# EAGLE design clock10 (EAGLE 7.7.0)

## Sheet 1 of 3
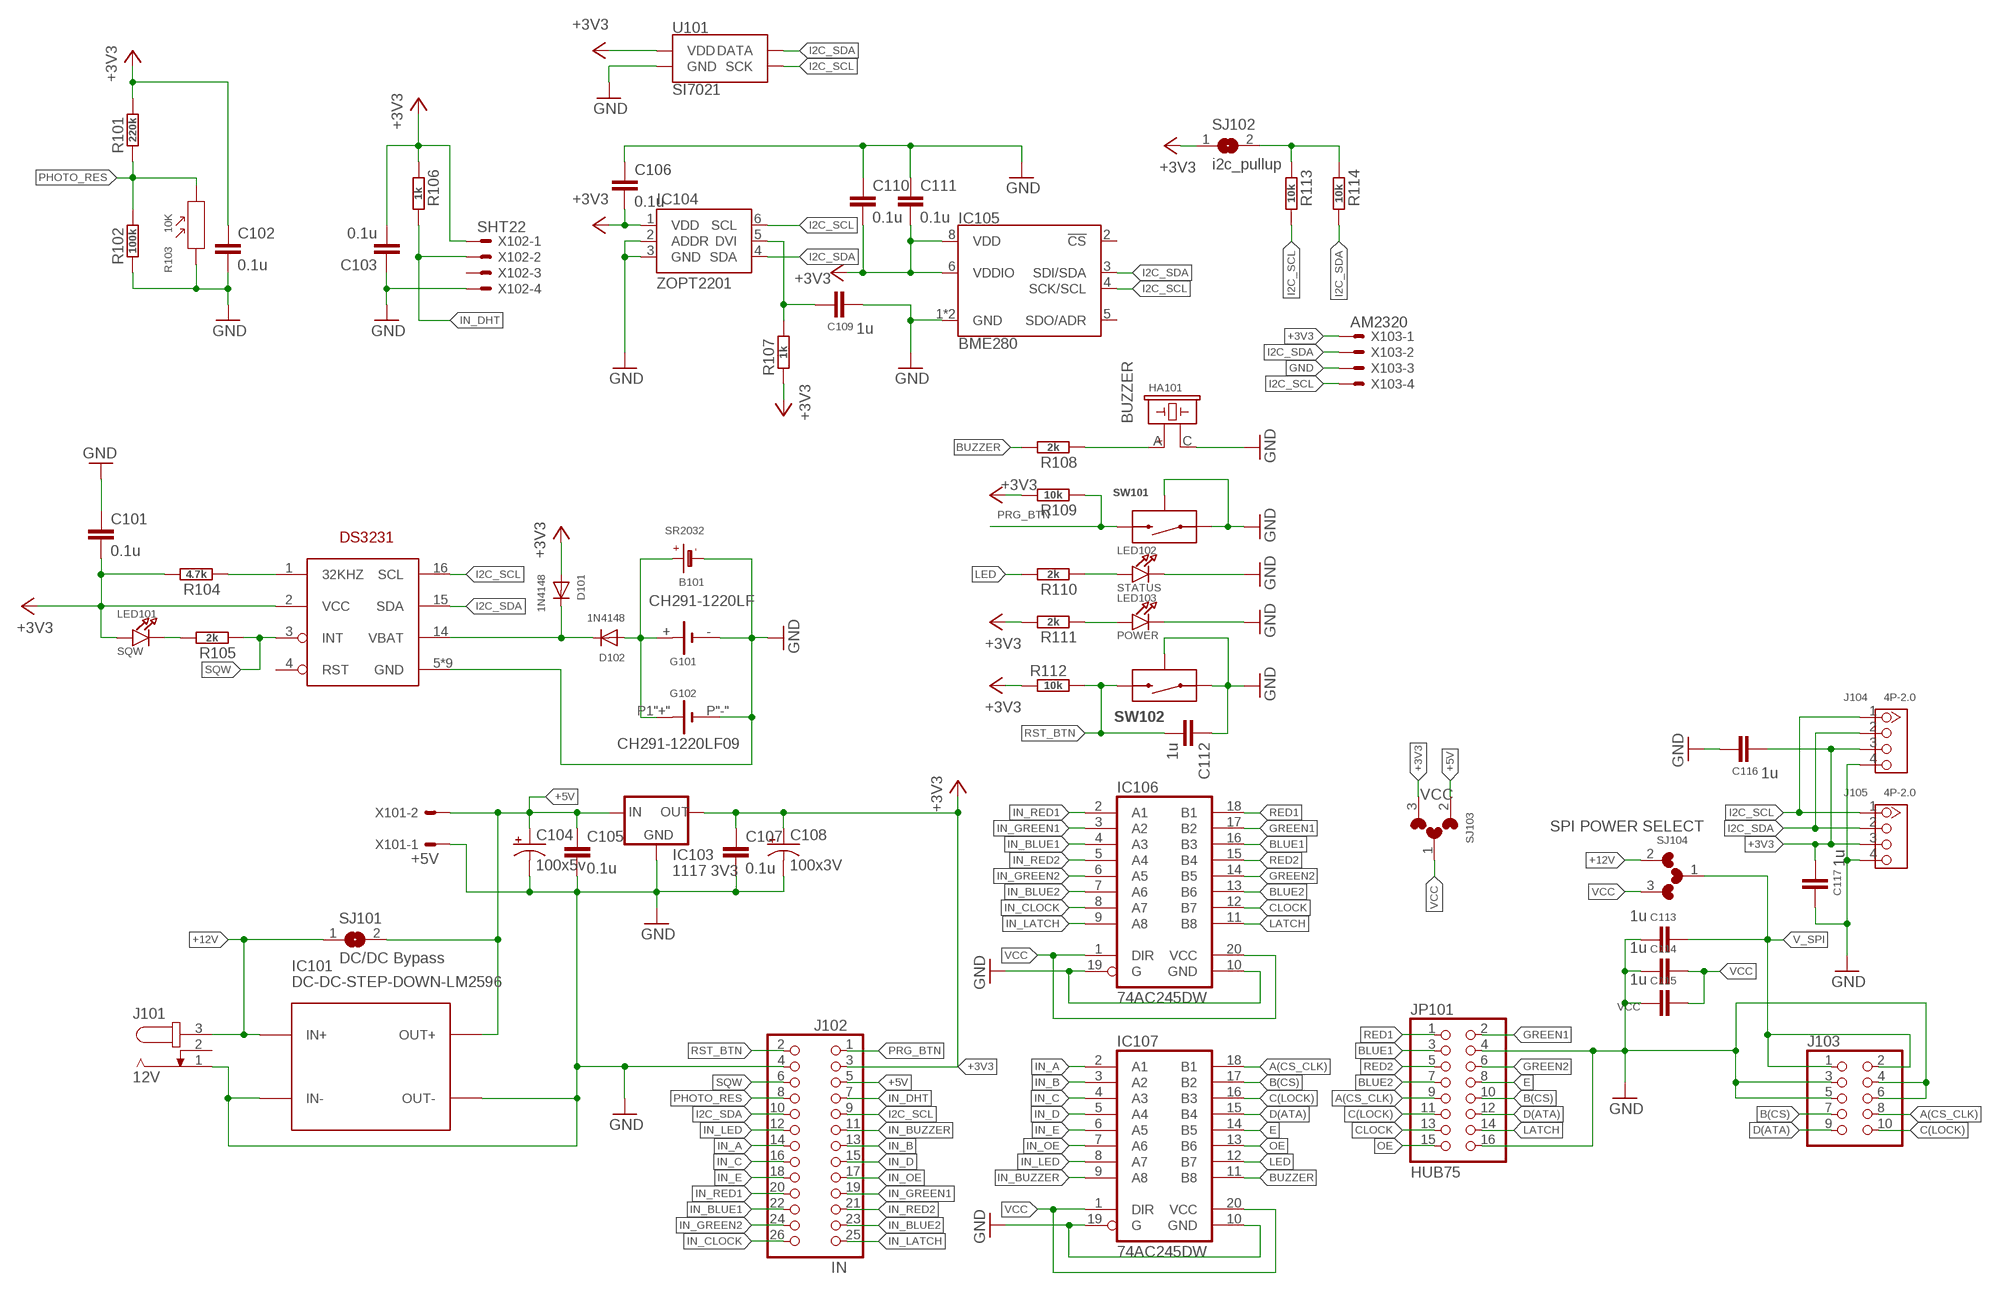
[diagram p0: schematic, sheet 1]

### Parts
B101  SR2032  BATTERYCR2032  [CR2032]
C101  0.1u  CAP0603-CAP  [0603-CAP]
C102  0.1u  CAP0603-CAP  [0603-CAP]
C103  0.1u  CAP0603-CAP  [0603-CAP]
C104  100x5v  CAP_POLPTH1  [CPOL-RADIAL-100UF-25V]
C105  0.1u  CAP0603-CAP  [0603-CAP]
C106  0.1u  CAP0603-CAP  [0603-CAP]
C107  0.1u  CAP0603-CAP  [0603-CAP]
C108  100x3V  CAP_POLPTH1  [CPOL-RADIAL-100UF-25V]
C109  1u  CAP0603-CAP  [0603-CAP]
C110  0.1u  CAP0603-CAP  [0603-CAP]
C111  0.1u  CAP0603-CAP  [0603-CAP]
C112  1u  CAP0603-CAP  [0603-CAP]
C113  1u  CAP0603-CAP  [0603-CAP]
C114  1u  CAP0603-CAP  [0603-CAP]
C115  1u  CAP0603-CAP  [0603-CAP]
C116  1u  CAP0603-CAP  [0603-CAP]
C117  1u  CAP0603-CAP  [0603-CAP]
D101  1N4148  DIODESOD-323F  [SOD-323F]
D102  1N4148  DIODESOD-323F  [SOD-323F]
G101  CH291-1220LF  [CH291-1220LF]
G102  CH291-1220LF09  [CH23-09LF]
HA101  BUZZER  PIEZO_BUZZERHYDZ12X7.5  [PBUZ_12X7.5]
IC101  DC-DC-STEP-DOWN-LM2596  [DC-DC-STEP-DOWN-LM2596]
IC102  DS3231W  [SO16W]
IC103  1117 3V3  V_REG_LD1117VXXSMD  [SOT223]
IC104  ZOPT2201  BH1750  [WSOF6L]
IC105  BME280  [LGA-8-2.5X2.5]
IC106  74AC245DW  [SO20W]
IC107  74AC245DW  [SO20W]
J101  12V  JACK-PLUG0  [SPC4077]
J102  IN  HEADER-2X13  [2X13]
J103  HEADER-2X5IDC  [2X05_IDC]
J104  4P-2.0  GROVE-CONNECTOR-DIP(4P-2.0)  [HW4-2.0]
J105  4P-2.0  GROVE-CONNECTOR-DIP(4P-2.0)  [HW4-2.0]
JP101  HUB75  PINHD-2X8  [2X08]
LED101  SQW  LED0603  [CHIPLED_0603]
LED102  STATUS  LED0603  [CHIPLED_0603]
LED103  POWER  LED0603  [CHIPLED_0603]
R101  220k  R-EU_R0603  [R0603]
R102  100k  R-EU_R0603  [R0603]
R103  10K  PHOTORESISTOR-5528-10K(2P-5.0X4.2MM)  [SNR2-3.0]
R104  4.7k  R-EU_R0603  [R0603]
R105  2k  R-EU_R0603  [R0603]
R106  1k  R-EU_R0603  [R0603]
R107  1k  R-EU_R0603  [R0603]
R108  2k  R-EU_R0603  [R0603]
R109  10k  R-EU_R0603  [R0603]
R110  2k  R-EU_R0603  [R0603]
R111  2k  R-EU_R0603  [R0603]
R112  10k  R-EU_R0603  [R0603]
R113  10k  R-EU_R0603  [R0603]
R114  10k  R-EU_R0603  [R0603]
SJ101  DC/DC Bypass  MICROBUILDER_SOLDERJUMPER  [MICROBUILDER_SOLDERJUMPER_ARROW_NOPASTE]
SJ102  i2c_pullup  MICROBUILDER_SOLDERJUMPER  [MICROBUILDER_SOLDERJUMPER_ARROW_NOPASTE]
SJ103  VCC  MICROBUILDER_SOLDERJUMPER3  [MICROBUILDER_SOLDERJUMPER_ARROW_NOPASTE_3]
SJ104  SPI POWER SELECT  MICROBUILDER_SOLDERJUMPER3  [MICROBUILDER_SOLDERJUMPER_ARROW_NOPASTE_3]
SW101  PRG  MICROSWITCH-BUTTON  [MICROPUSH-BUT_TOP]
SW102  RST  MICROSWITCH-BUTTON  [MICROPUSH-BUT_TOP]
U101  SI7021  [DFN-6-3X3-SI7021]
X101  +5V  C-GRID-02-70543  [70543-02]
X102  SHT22  C-GRID-04-70543  [70543-04]
X103  AM2320  C-GRID-04-70543  [70543-04]

### Nets
+3V3: C101.2 C102.1 C103.2 C106.2 C107.1 C108.1(+) C110.2 C111.2 C116.2 C117.2 D101.A IC102.2(VCC) IC103.2(OUT) IC103.4(OUT) IC104.1(VDD) IC105.6(VDDIO) IC105.8(VDD) J102.3 J104.3 J105.3 LED101.A R101.2 R104.2 R106.1 R107.1 R109.2 R111.2 R112.1 SJ102.1 SJ103.3 U101.VDD X102.1 X103.1
+5V: C104.1(+) C105.1 IC101.OUT+ IC103.3(IN) J102.5 SJ101.2 SJ103.2 X101.2
+12V: IC101.IN+ J101.3 SJ101.1 SJ104.2
A(CS_CLK): IC107.18(B1) J103.8 JP101.9
B(CS): IC107.17(B2) J103.7 JP101.10
BLUE1: IC106.16(B3) JP101.3
BLUE2: IC106.13(B6) JP101.7
BUZ: HA101.A R108.1
BUZZER: IC107.11(B8) R108.2
C(LOCK): IC107.16(B3) J103.10 JP101.11
CLOCK: IC106.12(B7) JP101.13
D(ATA): IC107.15(B4) J103.9 JP101.12
E: IC107.14(B5) JP101.8
GND: B101.- C101.1 C102.2 C103.1 C104.2(-) C105.2 C106.1 C107.2 C108.2(-) C109.2 C110.1 C111.1 C112.1 C113.2 C114.2 C115.2 C116.1 C117.1 G101.- G102.P"-"(-) HA101.C IC101.IN- IC101.OUT- IC102.5(GND) IC102.6(GND) IC102.7(GND) IC102.8(GND) IC102.9(GND) IC102.10(GND) IC102.11(GND) IC102.12(GND) IC102.13(GND) IC103.1(GND) IC104.2(ADDR) IC104.3(GND) IC105.1(GND) IC105.7(GND) IC106.10(GND) IC106.19(G) IC107.10(GND) IC107.19(G) J101.1 J102.4 J103.3 J103.4 J103.5 J103.6 J104.4 J105.4 JP101.4 JP101.16 LED102.C LED103.C R102.1 R103.1 SW101.A SW101.SH0(SH) SW102.A SW102.SH0(SH) U101.GND X101.1 X102.4 X103.3 ; also sheet 2,3
GREEN1: IC106.17(B2) JP101.2
GREEN2: IC106.14(B5) JP101.6
I2C_SCL: IC102.16(SCL) IC104.6(SCL) IC105.4(SCK/SCL) J102.9 J104.1 J105.1 R113.2 U101.SCK X103.4
I2C_SDA: IC102.15(SDA) IC104.4(SDA) IC105.3(SDI/SDA) J102.10 J104.2 J105.2 R114.2 U101.DATA X103.2
IN_A: IC107.2(A1) J102.14
IN_B: IC107.3(A2) J102.13
IN_BLUE1: IC106.4(A3) J102.22
IN_BLUE2: IC106.7(A6) J102.23
IN_BUZZER: IC107.9(A8) J102.11
IN_C: IC107.4(A3) J102.16
IN_CLOCK: IC106.8(A7) J102.26
IN_D: IC107.5(A4) J102.15
IN_DHT: J102.7 R106.2 X102.2
IN_E: IC107.6(A5) J102.18
IN_GREEN1: IC106.3(A2) J102.19
IN_GREEN2: IC106.6(A5) J102.24
IN_LATCH: IC106.9(A8) J102.25
IN_LED: IC107.8(A7) J102.12
IN_OE: IC107.7(A6) J102.17
IN_RED1: IC106.2(A1) J102.20
IN_RED2: IC106.5(A4) J102.21
LATCH: IC106.11(B8) JP101.14
LED: IC107.12(B7) R110.2
N$1: D101.C D102.C IC102.14(VBAT)
N$2: LED103.A R111.1
N$5: LED102.A R110.1
N$7: LED101.C R105.2
N$25: C109.1 IC104.5(DVI) R107.2
N$32: IC102.1(32KHZ) R104.1
N$39: R113.1 R114.1 SJ102.2
N$52: B101.+ D102.A G101.+ G102.P1"+"(+)
OE: IC107.13(B6) JP101.15
PHOTO_RES: J102.8 R101.1 R102.2 R103.2
PRG_BTN: J102.1 R109.1 SW101.B
RED1: IC106.18(B1) JP101.1
RED2: IC106.15(B4) JP101.5
RST_BTN: C112.2 J102.2 R112.2 SW102.B
SQW: IC102.3(INT) J102.6 R105.1
V_SPI: C113.1 J103.1 J103.2 SJ104.1
VCC: C114.1 C115.1 IC106.1(DIR) IC106.20(VCC) IC107.1(DIR) IC107.20(VCC) SJ103.1 SJ104.3
Unconnected: IC102.4(RST) IC105.2(!CS) IC105.5(SDO/ADR) J101.2 X102.3

## Sheet 2 of 3
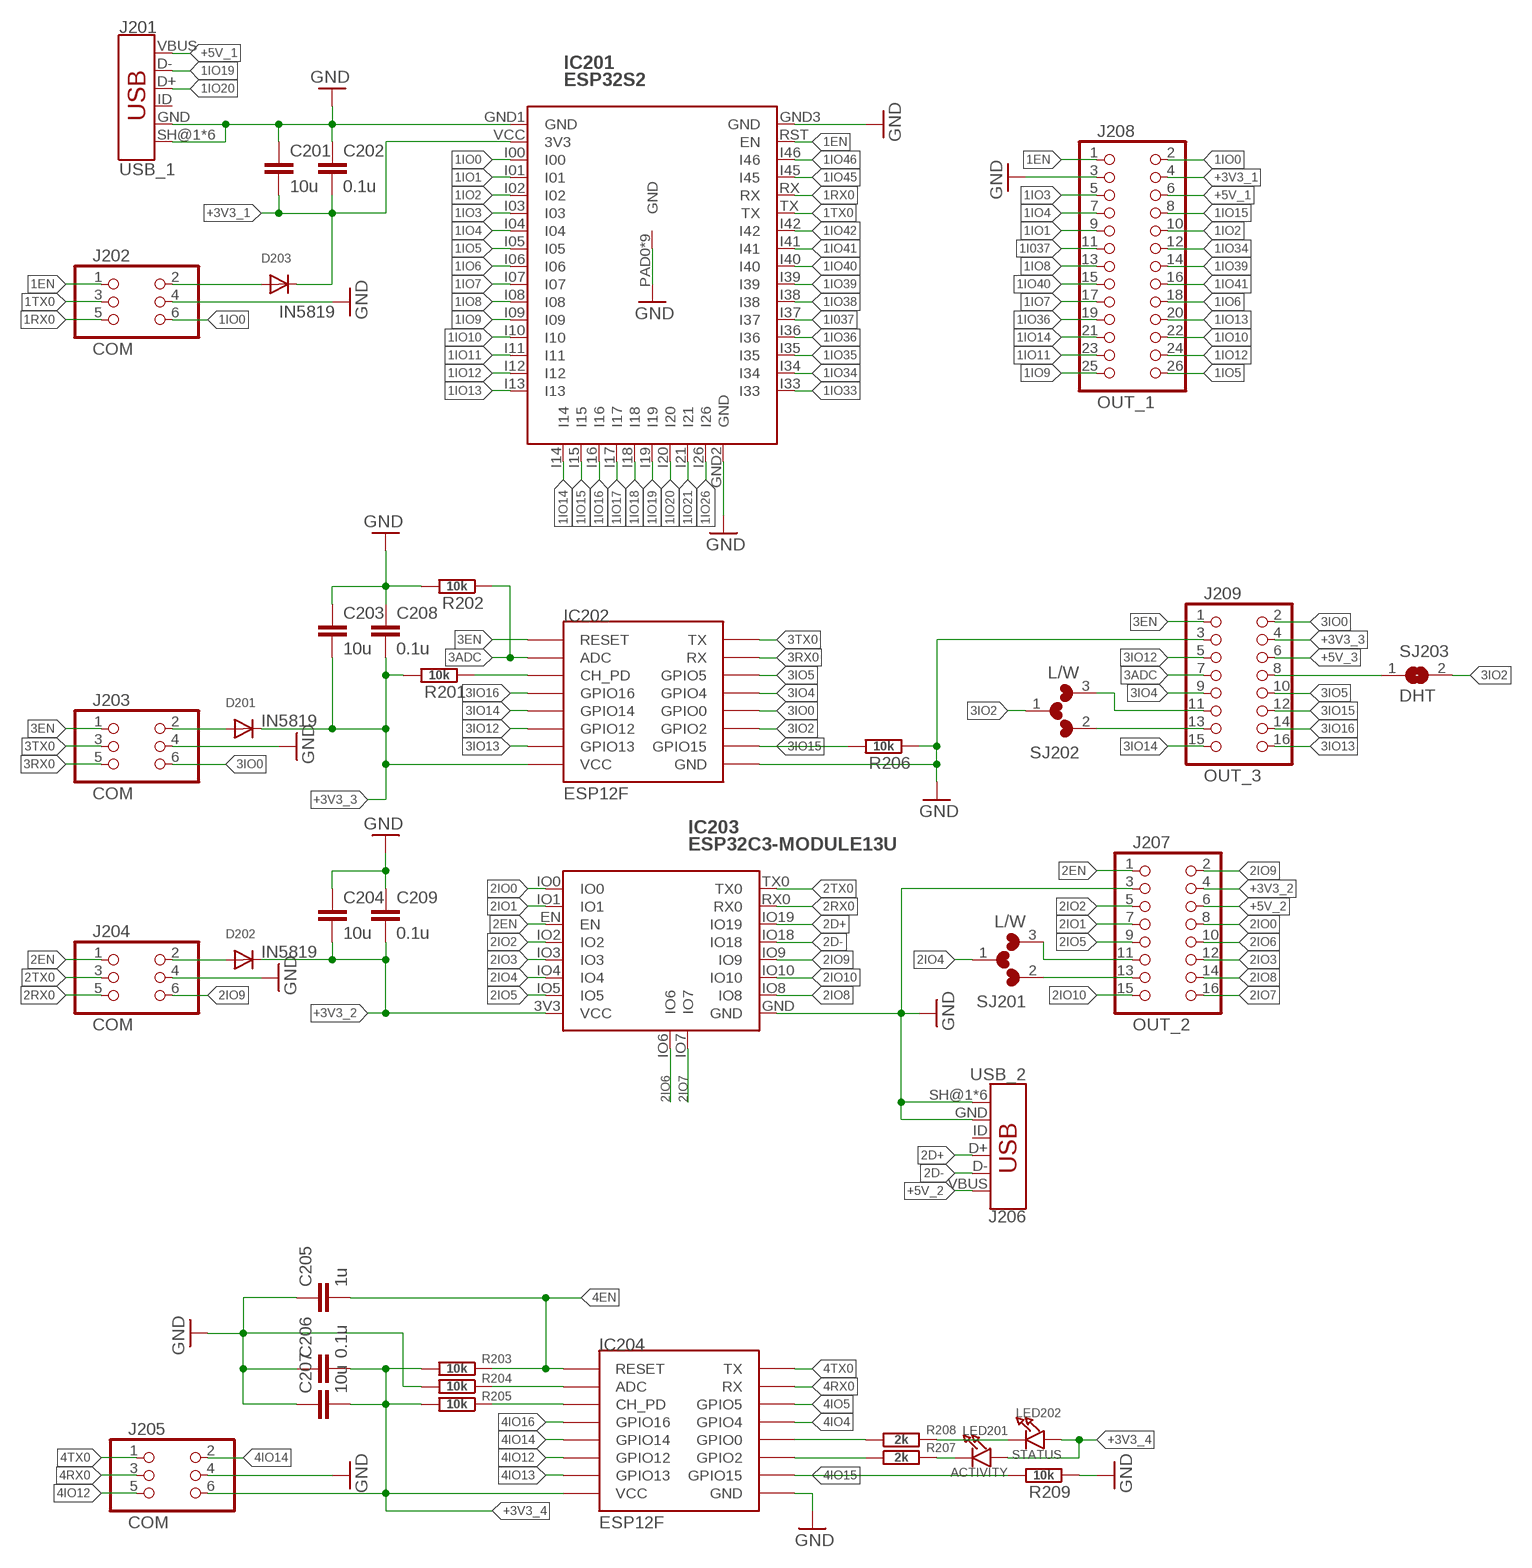
[diagram p1: schematic, sheet 2]

### Parts
C201  10u  CAP0603-CAP  [0603-CAP]
C202  0.1u  CAP0603-CAP  [0603-CAP]
C203  10u  CAP0603-CAP  [0603-CAP]
C204  10u  CAP0603-CAP  [0603-CAP]
C205  1u  CAP0603-CAP  [0603-CAP]
C206  0.1u  CAP0603-CAP  [0603-CAP]
C207  10u  CAP0603-CAP  [0603-CAP]
C208  0.1u  CAP0603-CAP  [0603-CAP]
C209  0.1u  CAP0603-CAP  [0603-CAP]
D201  IN5819  DIODE-SOD123  [SOD123]
D202  IN5819  DIODE-SOD123  [SOD123]
D203  IN5819  DIODE-SOD123  [SOD123]
IC201  ESP32S2  ESP32S2-MODULEAI  [ESP-12K]
IC202  ESP12F  ESP12SMD  [ESP12-SMD]
IC203  ESP32C3-MODULE13U  [ESP32C3-13U]
IC204  ESP12F  ESP12SMD  [ESP12-SMD]
J201  USB_1  USB_MICRO-BFEMALE_SMT_  [USB-B-MICRO-SMD_MY]
J202  COM  HEADER-2X3SMT  [2X03_SMT]
J203  COM  HEADER-2X3SMT  [2X03_SMT]
J204  COM  HEADER-2X3SMT  [2X03_SMT]
J205  COM  HEADER-2X3SMT  [2X03_SMT]
J206  USB_2  USB_MICRO-BFEMALE_SMT_  [USB-B-MICRO-SMD_MY]
J207  OUT_2  HEADER-2X8  [2X8]
J208  OUT_1  HEADER-2X13  [2X13]
J209  OUT_3  HEADER-2X8  [2X8]
LED201  ACTIVITY  LED0603  [CHIPLED_0603]
LED202  STATUS  LED0603  [CHIPLED_0603]
R201  10k  R-EU_R0603  [R0603]
R202  10k  R-EU_R0603  [R0603]
R203  10k  R-EU_R0603  [R0603]
R204  10k  R-EU_R0603  [R0603]
R205  10k  R-EU_R0603  [R0603]
R206  10k  R-EU_R0603  [R0603]
R207  2k  R-EU_R0603  [R0603]
R208  2k  R-EU_R0603  [R0603]
R209  10k  R-EU_R0603  [R0603]
SJ201  L/W  MICROBUILDER_SOLDERJUMPER3  [MICROBUILDER_SOLDERJUMPER_ARROW_NOPASTE_3]
SJ202  L/W  MICROBUILDER_SOLDERJUMPER3  [MICROBUILDER_SOLDERJUMPER_ARROW_NOPASTE_3]
SJ203  DHT  MICROBUILDER_SOLDERJUMPER  [MICROBUILDER_SOLDERJUMPER_ARROW_NOPASTE]

### Nets
1EN: IC201.RST(EN) J202.1 J208.1
1I037: IC201.I37 J208.11
1IO0: IC201.I00 J202.6 J208.2
1IO1: IC201.I01 J208.9
1IO2: IC201.I02 J208.10
1IO3: IC201.I03 J208.5
1IO4: IC201.I04 J208.7
1IO5: IC201.I05 J208.26
1IO6: IC201.I06 J208.18
1IO7: IC201.I07 J208.17
1IO8: IC201.I08 J208.13
1IO9: IC201.I09 J208.25
1IO10: IC201.I10 J208.22
1IO11: IC201.I11 J208.23
1IO12: IC201.I12 J208.24
1IO13: IC201.I13 J208.20
1IO14: IC201.I14 J208.21
1IO15: IC201.I15 J208.8
1IO16: IC201.I16
1IO17: IC201.I17
1IO18: IC201.I18
1IO19: IC201.I19 J201.D-
1IO20: IC201.I20 J201.D+
1IO21: IC201.I21
1IO26: IC201.I26
1IO33: IC201.I33
1IO34: IC201.I34 J208.12
1IO35: IC201.I35
1IO36: IC201.I36 J208.19
1IO38: IC201.I38
1IO39: IC201.I39 J208.14
1IO40: IC201.I40 J208.15
1IO41: IC201.I41 J208.16
1IO42: IC201.I42
1IO45: IC201.I45
1IO46: IC201.I46
1RX0: IC201.RX J202.5
1TX0: IC201.TX J202.3
2D+: IC203.IO19 J206.D+
2D-: IC203.IO18 J206.D-
2EN: IC203.EN J204.1 J207.1
2IO0: IC203.IO0 J207.8
2IO1: IC203.IO1 J207.7
2IO2: IC203.IO2 J207.5
2IO3: IC203.IO3 J207.12
2IO4: IC203.IO4 SJ201.1
2IO5: IC203.IO5 J207.9
2IO6: IC203.IO6 J207.10
2IO7: IC203.IO7 J207.16
2IO8: IC203.IO8 J207.14
2IO9: IC203.IO9 J204.6 J207.2
2IO10: IC203.IO10 J207.15
2RX0: IC203.RX0 J204.5
2TX0: IC203.TX0 J204.3
3ADC: IC202.ADC J209.7 R202.1
3EN: IC202.RESET J203.1 J209.1
3IO0: IC202.GPIO0 J203.6 J209.2
3IO2: IC202.GPIO2 SJ202.1 SJ203.2
3IO4: IC202.GPIO4 J209.9
3IO5: IC202.GPIO5 J209.10
3IO12: IC202.GPIO12 J209.5
3IO13: IC202.GPIO13 J209.16
3IO14: IC202.GPIO14 J209.15
3IO15: IC202.GPIO15 J209.12 R206.2
3IO16: IC202.GPIO16 J209.14
3RX0: IC202.RXD0(RX) J203.5
3TX0: IC202.TXD0(TX) J203.3
4EN: C205.2 IC204.RESET R203.1
4IO0: IC204.GPIO0 R208.1
4IO2: IC204.GPIO2 R207.1
4IO4: IC204.GPIO4
4IO5: IC204.GPIO5
4IO12: IC204.GPIO12 J205.5
4IO13: IC204.GPIO13
4IO14: IC204.GPIO14 J205.2
4IO15: IC204.GPIO15 R209.2
4IO16: IC204.GPIO16
4RX0: IC204.RXD0(RX) J205.3
4TX0: IC204.TXD0(TX) J205.1
+3V3_1: C201.2 C202.2 D203.C IC201.VCC(3V3) J208.4
+3V3_2: C204.2 C209.2 D202.C IC203.3V3(VCC) J207.4
+3V3_3: C203.2 C208.2 D201.C IC202.VCC J209.4 R201.2
+3V3_4: C206.2 C207.2 IC204.VCC J205.6 LED201.A LED202.A R203.2 R205.2
+5V_1: J201.VBUS J208.6
+5V_2: J206.VBUS J207.6
+5V_3: J209.6
COM_VCC2: D201.A J203.2
GND: C201.1 C202.1 C203.1 C204.1 C205.1 C206.1 C207.1 C208.1 C209.1 IC201.GND1(GND) IC201.GND2(GND) IC201.GND3(GND) IC201.PAD0(GND) IC201.PAD1(GND) IC201.PAD2(GND) IC201.PAD3(GND) IC201.PAD4(GND) IC201.PAD5(GND) IC201.PAD6(GND) IC201.PAD7(GND) IC201.PAD8(GND) IC202.GND IC203.GND IC204.GND J201.GND J201.SH@1(SHIELD) J201.SH@2(SHIELD) J201.SH@3(SHIELD) J201.SH@4(SHIELD) J201.SH@5(SHIELD) J201.SH@6(SHIELD) J202.4 J203.4 J204.4 J205.4 J206.GND J206.SH@1(SHIELD) J206.SH@2(SHIELD) J206.SH@3(SHIELD) J206.SH@4(SHIELD) J206.SH@5(SHIELD) J206.SH@6(SHIELD) J207.3 J208.3 J209.3 R202.2 R204.2 R206.1 R209.1 ; also sheet 1,3
IN2_A: J207.13 SJ201.2
IN3_DHT: J209.8 SJ203.1
N$4: D203.A J202.2
N$6: IC202.CH_PD R201.1
N$8: D202.A J204.2
N$9: IC204.CH_PD R205.1
N$10: IC204.ADC R204.1
N$11: LED202.C R208.2
N$12: LED201.C R207.2
N$13: J209.13 SJ202.2
N$14: J209.11 SJ202.3
N$15: J207.11 SJ201.3
Unconnected: J201.ID J206.ID

## Sheet 3 of 3
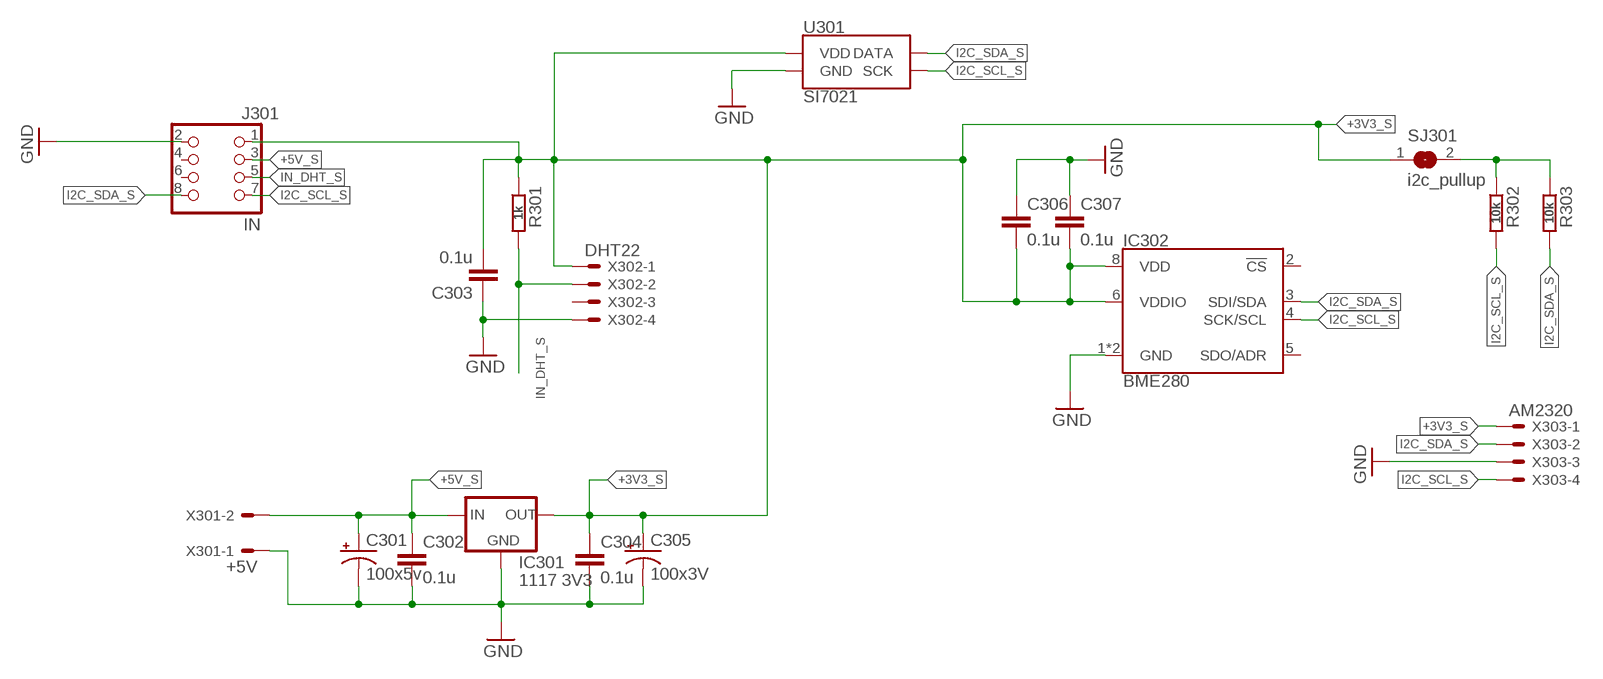
[diagram p2: schematic, sheet 3]

### Parts
C301  100x5v  CAP_POLPTH1  [CPOL-RADIAL-100UF-25V]
C302  0.1u  CAP0603-CAP  [0603-CAP]
C303  0.1u  CAP0603-CAP  [0603-CAP]
C304  0.1u  CAP0603-CAP  [0603-CAP]
C305  100x3V  CAP_POLPTH1  [CPOL-RADIAL-100UF-25V]
C306  0.1u  CAP0603-CAP  [0603-CAP]
C307  0.1u  CAP0603-CAP  [0603-CAP]
IC301  1117 3V3  V_REG_LD1117VXXSMD  [SOT223]
IC302  BME280  [LGA-8-2.5X2.5]
J301  IN  HEADER-2X4  [2X04]
R301  1k  R-EU_R0603  [R0603]
R302  10k  R-EU_R0603  [R0603]
R303  10k  R-EU_R0603  [R0603]
SJ301  i2c_pullup  MICROBUILDER_SOLDERJUMPER  [MICROBUILDER_SOLDERJUMPER_ARROW_NOPASTE]
U301  SI7021  [DFN-6-3X3-SI7021]
X301  +5V  C-GRID-02-70543  [70543-02]
X302  DHT22  C-GRID-04-70543  [70543-04]
X303  AM2320  C-GRID-04-70543  [70543-04]

### Nets
+3V3_S: C303.2 C304.1 C305.1(+) C306.2 C307.2 IC301.2(OUT) IC301.4(OUT) IC302.6(VDDIO) IC302.8(VDD) J301.1 R301.1 SJ301.1 U301.VDD X302.1 X303.1
+5V_S: C301.1(+) C302.1 IC301.3(IN) J301.3 X301.2
GND: C301.2(-) C302.2 C303.1 C304.2 C305.2(-) C306.1 C307.1 IC301.1(GND) IC302.1(GND) IC302.7(GND) J301.2 U301.GND X301.1 X302.4 X303.3 ; also sheet 1,2
I2C_SCL_S: IC302.4(SCK/SCL) J301.7 R302.2 U301.SCK X303.4
I2C_SDA_S: IC302.3(SDI/SDA) J301.8 R303.2 U301.DATA X303.2
IN_DHT_S: J301.5 R301.2 X302.2
N$3: R302.1 R303.1 SJ301.2
Unconnected: IC302.2(!CS) IC302.5(SDO/ADR) J301.4 J301.6 X302.3

## Library data of the parts
B101 = radiva5:BATTERY: CR1220 SMT - Digikey: 3001K-ND
C101-C103 C105-C107 C109-C117 C201-C209 C302-C304 C306 C307 = radiva5:CAP: Capacitor Standard 0603 ceramic capacitor, and 0.1" leaded capacitor.
C104 C108 C301 C305 = radiva5:CAP_POL: Capacitor Polarized These are standard SMD and PTH capacitors. Normally 10uF, 47uF, and 100uF in electrolytic and tantalum varieties. Always verify the external diameter of the through hole cap, it varies with capacity, voltage, and manufacturer. The EIA devices should be standard.
D101 D102 = clock02:DIODE: Diode SMADIODE - SMA Surface Mount Package 20V 1A Schottky Diode Digikey: 641-1014-6-ND DO-1N4148 - Through Hole Small Current Diode SOD-123 20V 1 A (.5mV Vf) Schottky Diode - Digikey: MBRX120TPMSCT-ND SOD-323 10V 570mA (.38mV Vf, 3ns) Schottky Diode - Digikey: ZLLS410CT-ND SOD-523 30V 30mA Schottky Diode (RB751S-40TE61) - Digikey: RB751S-40TE61CT-ND SOT23-R/W - SOT23 Package (R = Solder Paste/Reflow Ovens, W = Hand-Soldering) BAT54Film 40V 300mA - Digikey: 497-7162-1-ND
D201-D203 = radiva5:DIODE-: DIODE
G101 G102 = clock02:CH291-1220LF: Battery Holder, SMT, 12mm multicomp PART NO. CH291-1220LF Source: Data sheet <http://www.farnell.com/datasheets/1505860.pdf>
HA101 = radiva5:PIEZO_BUZZER: Generic Piezo Buzzer Package(s): 12 mm dia, 7.6 mm (Pitch)
IC101 = diy-modules:DC-DC-STEP-DOWN-LM2596: DC/DC Step-Down Regulator based on LM2596-ADJ chip LM2596 datasheet available here: http://www.ti.com/lit/ds/symlink/lm2596.pdf Click here to find device on ebay.com <http://www.ebay.com/sch/lm2596+power+regulator>
IC102 = radiva5:DS3231
IC103 IC301 = radiva5:V_REG_LD1117VXX: LD1117VXX voltage regulator. We carry the 3.3V version (COM-00526) in TO-220 package.; PROD_ID: VREG-13917
IC104 = radiva5:BH1750; PROD_ID: IC-13876
IC105 IC302 = radiva5:BME280: Bosch BME280 – Combined Humidity and Pressure Sensor The BME280 is as combined digital humidity, pressure and temperature sensor based on proven sensing principles. The sensor module is housed in an extremely compact metal-lid LGA package with a footprint of only 2.5×2.5mm² with a height of 0.93mm. Its small dimensions and its low power consumption allow the implementation in battery driven devices such as handsets, GPS modules or watches. Datasheet <https://cdn.sparkfun.com/assets/learn_tutorials/4/1/9/BST-BME280_DS001-10.pdf> SparkFun Products SparkFun Atmospheric Sensor Breakout - BME280 <https://www.sparkfun.com/products/13676> (SEN-13676); PROD_ID: IC-13090
IC106 IC107 = 74xx-eu:74*245: Octal BUS TRANSCEIVER, 3-state
IC201 = radiva5:ESP32S2-MODULE
IC202 IC204 = esp8266modules:ESP12: ESP8266 Wifi module 12
IC203 = radiva5:ESP32C3-MODULE
J101 = con-jack:JACK-PLUG: DC POWER JACK Power Jack, DC, Right Angle, Through Hole, Rated 5A at 16VDC, PC Terminals Distributor: Farnell (www.Farnell.de) Drawing: 84N1161.pdf / 84N1162.pdf Manufacturer: SPC Technology (www.spctechnology.com) Type: SPC4077 / SPC 4078; OC_FARNELL: unknown; OC_NEWARK: unknown
J102 J208 = radiva5:HEADER-2X13: PIN HEADER
J103 = radiva5:HEADER-2X5: PIN HEADER
J104 J105 = radiva5:GROVE-CONNECTOR-DIP(4P-2.0): 320110033
J201 J206 = radiva5:USB_MICRO-B: USB Type Micro-B Connector Male/female and PTH/SMT variants SparkFun Products: SparkFun microB USB Breakout <?https://www.sparkfun.com/products/12035?> SparkFun USB microB Plug Breakout <?https://www.sparkfun.com/products/10031?> SparkFun ESP8266 Thing <?https://www.sparkfun.com/products/13231?>
J202-J205 = radiva5:HEADER-2X3: PIN HEADER
J207 J209 = radiva5:HEADER-2X8: PIN HEADER
J301 = radiva5:HEADER-2X4: PIN HEADER
JP101 = pinhead:PINHD-2X8: PIN HEADER
LED101-LED103 LED201 LED202 = radiva5:LED: LED 0603 - 0603 Surface Mount Package 2mA: Green LED - Low Power (3.9mcd, 2ma, 1.7Vf) - Digikey: 475-2709-2-ND Orange LED - Low Power (9.8mcd, 2ma, 1.8Vf) - Digikey: 475-1194-2-ND Red LED - Low Power (5mcd, 2ma, 1.8Vf) - Digikey: 475-1195-2-ND Yellow LED - Low Power (7mcd, 2ma, 1.8Vf) - Digikey: 475-1196-2-ND 5mA: Blue LED - Low Power (17mcd, 5ma, 2.9Vf) - Digikey: LNJ937W8CRACT-ND 0805 - 0805 Surface Mount Package 2mA: Red LED (8.8mcd, 2mA, 1.8Vf, Clear) - Low Power [Digikey: 475-2510-1-ND] Green LED (5mcd, 2mA, 1.8Vf, Clear) - Low Power [Digikey: 475-2730-1-ND] Yellow LED (11.3mcd, 2mA, 1.8Vf, Clear) - Low Power [Digikey: 475-2555-1-ND] 20mA: Red LED (104mcd, 20mA, Diffused) - LS R976 [Digikey: 475-1278-6-ND] Red LED (12mcd, 20mA, 2.0Vf, Clear) - APT2012EC [Digikey: 754-1128-1-ND] Green LED (15mcd, 20mA, 2.2Vf, Clear) - APT2012GC [Digikey: 754-1131-1-ND] Orange LED (160mcd, 20mA, 2.1Vf, Clear) - APT2012SECK [Digikey: 754-1130-1-ND] 1206 - 1206 Surface Mount Package Green LED (26mcd, 20mA, Diffused) - LG N971 [Digikey: 475-1407-6-ND] Red LED (15mcd, 20mA, Diffused) - LH N974 [Digikey: 475-1416-6-ND]
R101 R102 R104-R114 R201-R209 R301-R303 = radiva5:R-EU_: RESISTOR, European symbol
R103 = radiva5:PHOTORESISTOR-5528-10K(2P-5.0X4.2MM): 314020017; MPN: PHOTORESISTOR-5528-10K; VALUE: PHOTORESISTOR-5528-10K
SJ101 SJ102 SJ203 SJ301 = radiva5:MICROBUILDER_SOLDERJUMPER: SMD Solder JUMPER Solder the two pads together to create a connection, or remove the solder to break it. REFLOW - Use this footprint for solder paste and reflow ovens. WAVE - Use this footprint for hand-soldering (larger pads). CLOSED - Has a trace between the two pads to ensure it is closed by default. The trace needs to be cut to disable the jumper, and can be closed again by creating a solder bridge between the two pads.; BOM: EXCLUDE
SJ103 SJ104 SJ201 SJ202 = radiva5:MICROBUILDER_SOLDERJUMPER3: SMD Solder JUMPER Solder the two pads together to create a connection, or remove the solder to break it. REFLOW - Use this footprint for solder paste and reflow ovens. WAVE - Use this footprint for hand-soldering (larger pads). CLOSED - Has a trace between the two pads to ensure it is closed by default. The trace needs to be cut to disable the jumper, and can be closed again by creating a solder bridge between the two pads.
SW101 SW102 = radiva5:MICROSWITCH-BUTTON
U101 U301 = radiva5:SI7021: Silicon Labs Si7021 I2C Humidity and Temperature Sensor The Si7021 is a low-cost, easy-to-use, highly accurate, digital humidity and temperature sensor. This sensor is ideal for environmental sensing and data logging and perfect for build a weather stations or humidor control system. All you need are two lines for I2C communication, and you’ll have relative humidity readings and very accurate temperature readings as a bonus! Datasheet <https://cdn.sparkfun.com/datasheets/Sensors/Weather/Si7021.pdf> SparkFun Products SparkFun Humidity and Temperature Sensor Breakout - Si7021 <https://www.sparkfun.com/products/13763> (SEN-13763) SparkFun Blynk Board - ESP8266 <https://www.sparkfun.com/products/13794> (WRL-13794); PROD_ID: IC-13093
X101 X301 = con-molex:C-GRID-02: CONNECTOR wire to board 2.54 mm (0.100") pitch header; OC_FARNELL: unknown; OC_NEWARK: unknown
X102 X103 X302 X303 = con-molex:C-GRID-04: CONNECTOR wire to board 2.54 mm (0.100") pitch header; OC_FARNELL: unknown; OC_NEWARK: unknown

## Net classes
0 default: clearance 0.205 mm
1 power: width 0.406 mm

## Board
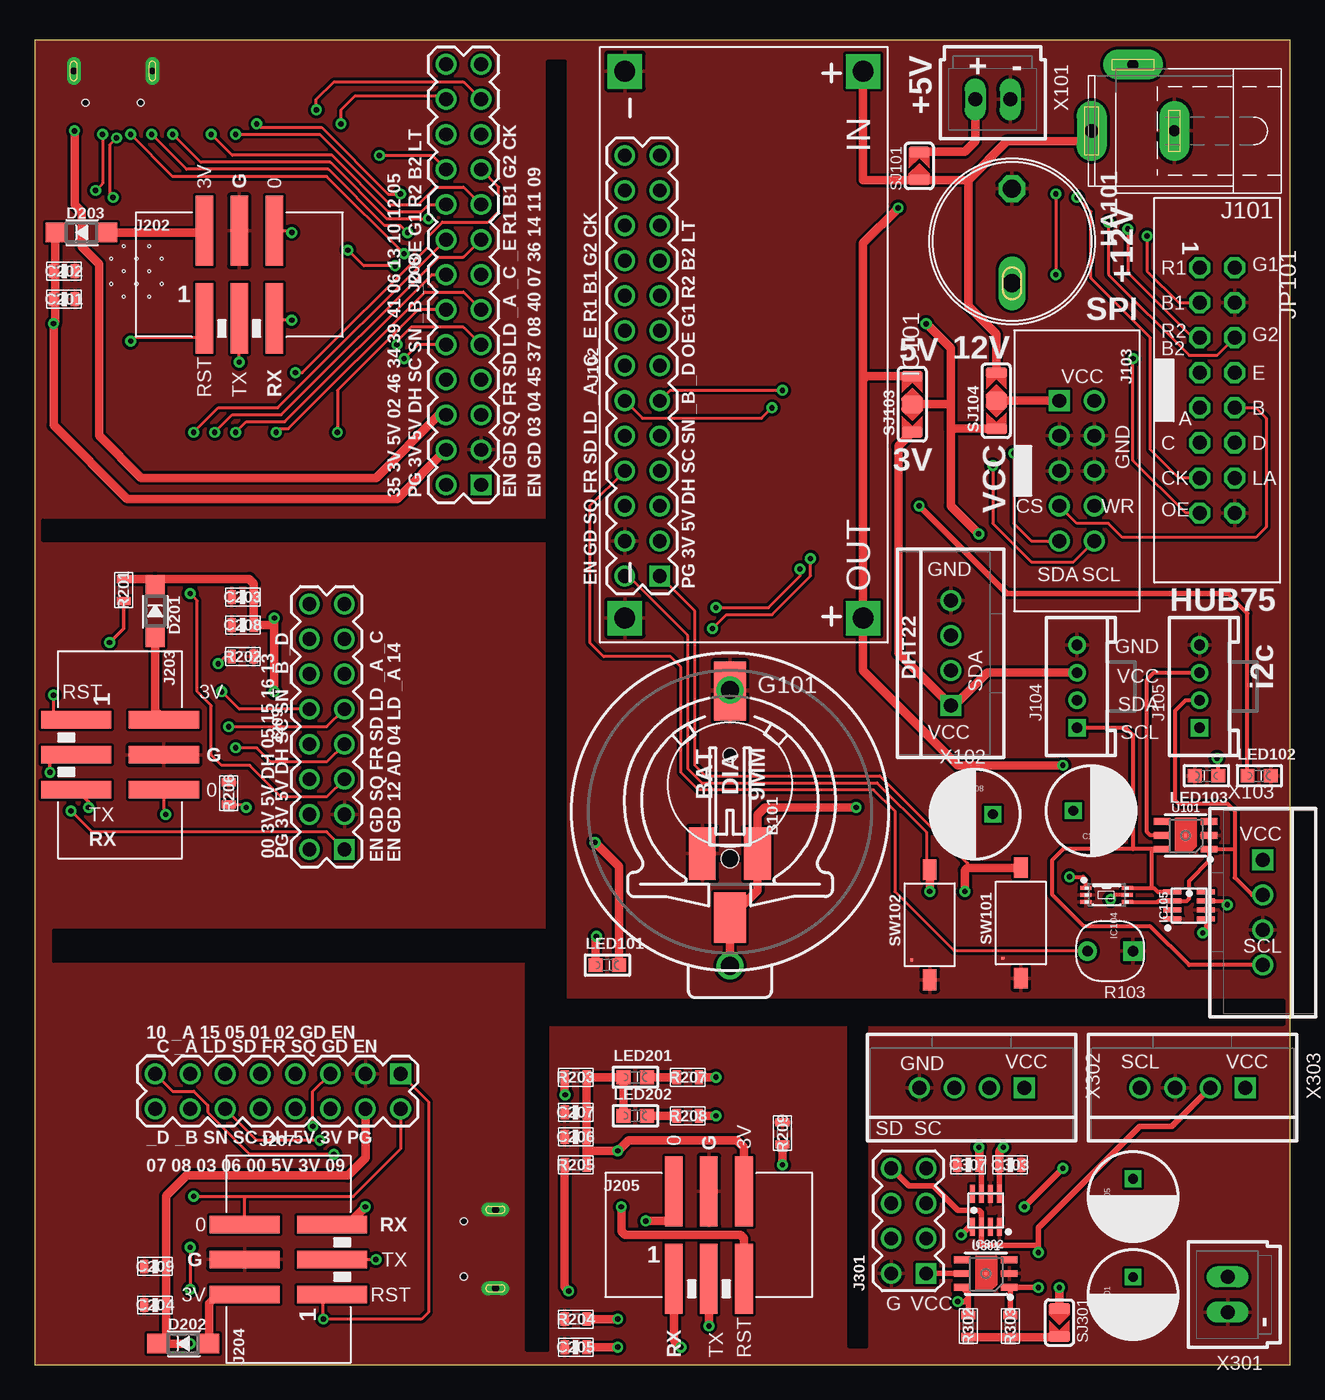
[diagram p3: board, top side]
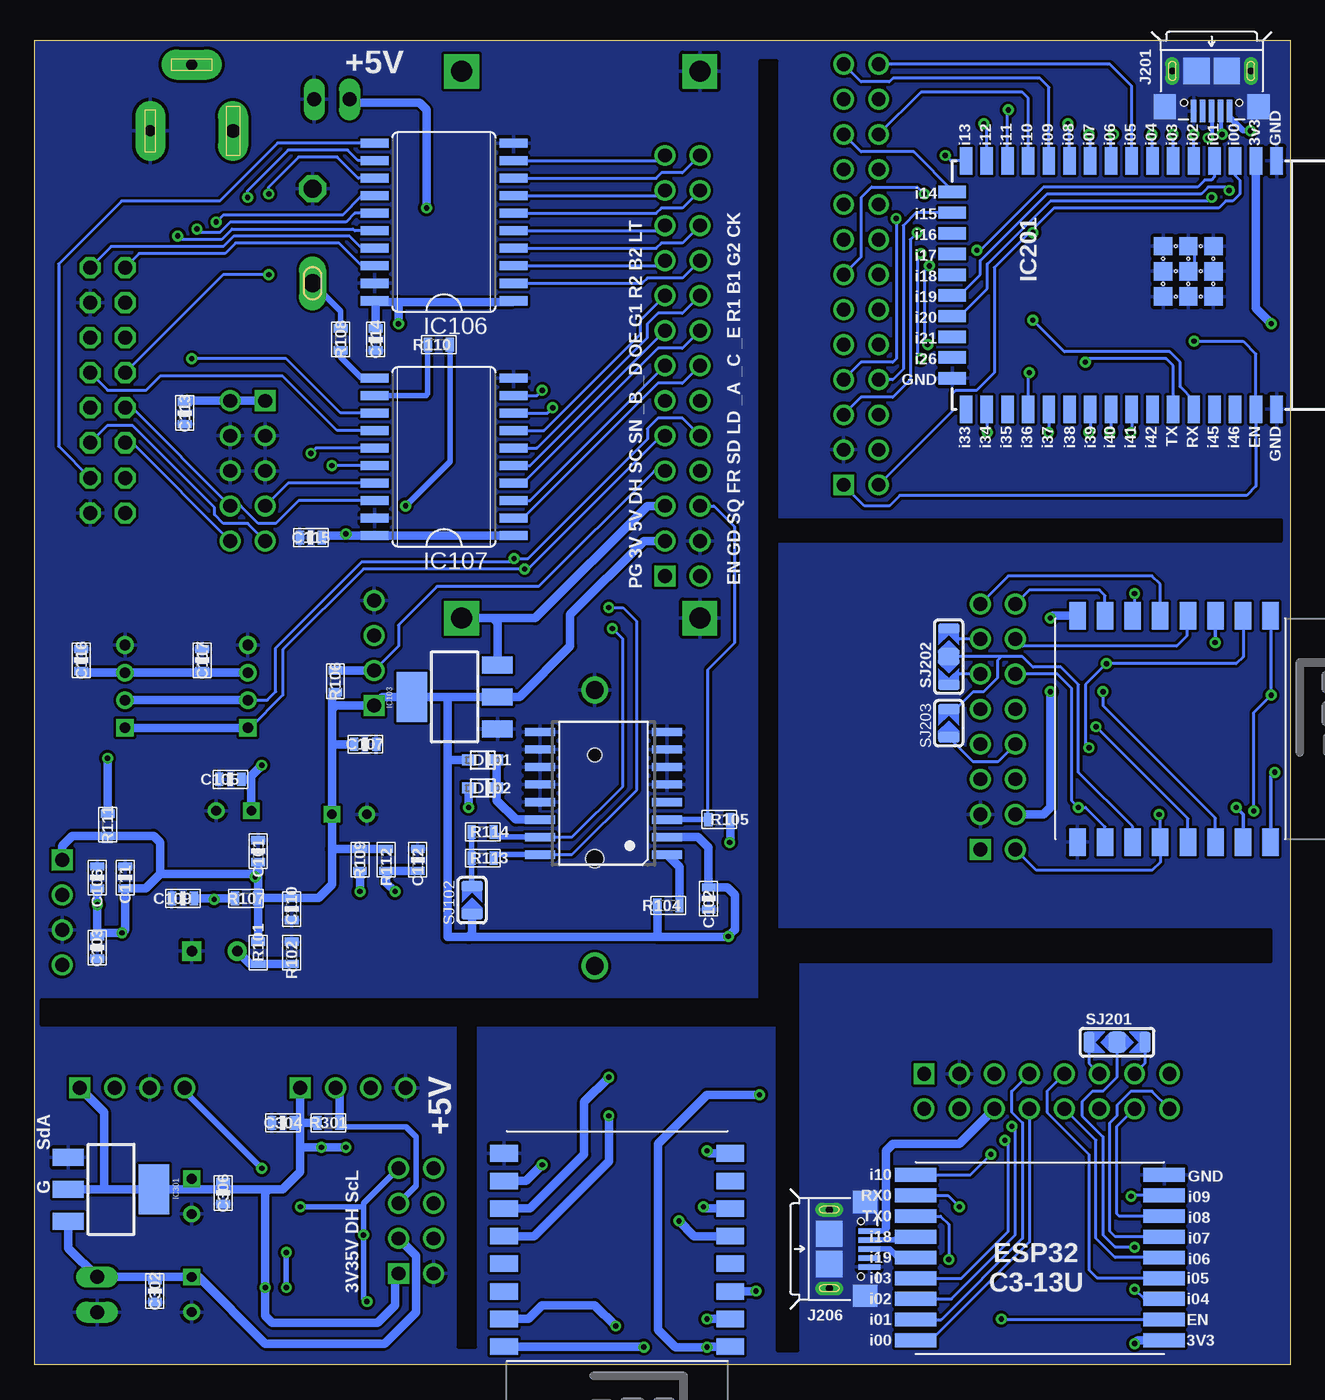
[diagram p4: board, bottom side, seen from below]

Size 91 x 96 mm. Coordinates in mm from the lower left corner, seen from the top.
Outline: 0,96 0,0 91,0 91,96 0,96
Copper layers (1*16): Top 0.035mm / dielectric 1.5mm / Bottom 0.035mm
Design rules "default *": minimum track width 8mil, minimum drill 15mil, track to track 8mil, track to pad 8mil, pad to pad 8mil, via to via 8mil, smd to smd 8mil, copper to edge 1mil, drill to drill 8mil, minimum pad ring 10mil, minimum via ring 8mil, stop-mask expansion 4mil, vias tented up to drill 20mil, thermal gap 10mil

### Footprints (pad centres in the part's own frame; a part is rotated, then mirrored left to right if it is on the bottom)
CR2032 = drill 1.3: + 11.5,0; - -8.5,0
0603-CAP = smd 0.6 x 1: 1 -0.8,0; 2 0.8,0
CPOL-RADIAL-100UF-25V = drill 0.7 square: 1 1.27,0 | drill 0.7: 2 -1.27,0
SOD-323F = smd 1 x 0.8: A -1,0; C 1,0
SOD123 = smd 1.4 x 1.4: A 1.9,0; C -1.9,0
CH291-1220LF = smd 2.3 x 3.66: + 0,-2.296 | smd 2.3 x 4.3: - 0,14.146 | hole 1.3: 0,2 | hole 1: 0,9.5
CH23-09LF = smd 3.81 x 1.93: P1"+" 5,2; P"-" 5,-2
PBUZ_12X7.5 = drill 1.3 long: A 3.038,0 | drill 1.3 octagon: C -3.8,0
DC-DC-STEP-DOWN-LM2596 = drill 1.5 pad 2.5 square: IN+ -19.812,8.636; IN- -19.812,-8.636; OUT+ 19.812,8.636; OUT- 19.812,-8.636
SO16W = smd 0.6 x 2.2: 1 -4.445,-4.6; 2 -3.175,-4.6; 3 -1.905,-4.6; 4 -0.635,-4.6; 5 0.635,-4.6; 6 1.905,-4.6; 7 3.175,-4.6; 8 4.445,-4.6; 9 4.445,4.6; 10 3.175,4.6; 11 1.905,4.6; 12 0.635,4.6; 13 -0.635,4.6; 14 -1.905,4.6; 15 -3.175,4.6; 16 -4.445,4.6
SOT223 = smd 1.219 x 2.235: 1 -2.311,-3.099; 2 0,-3.099; 3 2.311,-3.099 | smd 3.6 x 2.2: 4 0,3.099
WSOF6L = smd 0.3 x 0.8: 1 -0.5,-1.5; 2 0,-1.5; 3 0.5,-1.5; 4 0.5,1.5; 5 0,1.5; 6 -0.5,1.5
LGA-8-2.5X2.5 = smd 0.35 x 1.3: 1 -0.975,1.2; 2 -0.325,1.2; 3 0.325,1.2; 4 0.975,1.2; 5 0.975,-1.2; 6 0.325,-1.2; 7 -0.325,-1.2; 8 -0.975,-1.2
SO20W = smd 0.66 x 2.032: 1 -5.715,-5.029; 2 -4.445,-5.029; 3 -3.175,-5.029; 4 -1.905,-5.029; 5 -0.635,-5.029; 6 0.635,-5.029; 7 1.905,-5.029; 8 3.175,-5.029; 9 4.445,-5.029; 10 5.715,-5.029; 11 5.715,5.029; 12 4.445,5.029; 13 3.175,5.029; 14 1.905,5.029; 15 0.635,5.029; 16 -0.635,5.029; 17 -1.905,5.029; 18 -3.175,5.029; 19 -4.445,5.029; 20 -5.715,5.029
ESP-12K = smd 2 x 0.9: GND1 -9,7.5; GND3 9,7.5; I00 -9,4.5; I01 -9,3; I02 -9,1.5; I03 -9,0; I04 -9,-1.5; I05 -9,-3; I06 -9,-4.5; I07 -9,-6; I08 -9,-7.5; I09 -9,-9; I10 -9,-10.5; I11 -9,-12; I12 -9,-13.5; I13 -9,-15; I33 9,-15; I34 9,-13.5; I35 9,-12; I36 9,-10.5; I37 9,-9; I38 9,-7.5; I39 9,-6; I40 9,-4.5; I41 9,-3; I42 9,-1.5; I45 9,3; I46 9,4.5; RST 9,6; RX 9,1.5; TX 9,0; VCC -9,6 | smd 0.9 x 2: GND2 6.75,-16; I14 -6.75,-16; I15 -5.25,-16; I16 -3.75,-16; I17 -2.25,-16; I18 -0.75,-16; I19 0.75,-16; I20 2.25,-16; I21 3.75,-16; I26 5.25,-16 | smd 1.33 x 1.33: PAD0 -2.825,2.925; PAD1 -1,2.925; PAD2 0.825,2.925; PAD3 -2.825,1.1; PAD4 -1,1.1; PAD5 0.825,1.1; PAD6 -2.825,-0.725; PAD7 -1,-0.725; PAD8 0.825,-0.725 | hole 0.2: -2.825,0.188; -1,0.188; -2.825,2.013; 0.825,0.188; 0.825,2.013; -1,2.013; -1.913,-0.725; -1.913,1.1; -1.913,2.925; -0.087,-0.725; -0.087,1.1; -0.087,2.925
ESP12-SMD = smd 2 x 1.2: ADC -8.3,3.8; CH_PD -8.3,1.8; GND 8.1,-8.2; GPIO0 8.1,-2.2; GPIO2 8.1,-4.2; GPIO4 8.1,-0.2; GPIO5 8.1,1.8; GPIO12 -8.3,-4.2; GPIO13 -8.3,-6.2; GPIO14 -8.3,-2.2; GPIO15 8.1,-6.2; GPIO16 -8.3,-0.2; RESET -8.3,5.8; RXD0 8.1,3.8; TXD0 8.1,5.8; VCC -8.3,-8.2
ESP32C3-13U = smd 3 x 1: 3V3 -9,5.6; EN -9,4.1; GND -9,-6.4; IO0 9,5.6; IO1 9,4.1; IO2 9,2.6; IO3 9,1.1; IO4 -9,2.6; IO5 -9,1.1; IO6 -9,-0.4; IO7 -9,-1.9; IO8 -9,-3.4; IO9 -9,-4.9; IO10 9,-6.4; IO18 9,-1.9; IO19 9,-0.4; RX0 9,-4.9; TX0 9,-3.4
SPC4077 = drill 0.8 pad 2.184 long: 1 -3,0; 2 0,-4.8 | drill 1 pad 2.184 long: 3 3,0
2X13 = drill 1 square: 1 -15.24,-1.27 | drill 1: 2 -15.24,1.27; 3 -12.7,-1.27; 4 -12.7,1.27; 5 -10.16,-1.27; 6 -10.16,1.27; 7 -7.62,-1.27; 8 -7.62,1.27; 9 -5.08,-1.27; 10 -5.08,1.27; 11 -2.54,-1.27; 12 -2.54,1.27; 13 0,-1.27; 14 0,1.27; 15 2.54,-1.27; 16 2.54,1.27; 17 5.08,-1.27; 18 5.08,1.27; 19 7.62,-1.27; 20 7.62,1.27; 21 10.16,-1.27; 22 10.16,1.27; 23 12.7,-1.27; 24 12.7,1.27; 25 15.24,-1.27; 26 15.24,1.27
2X05_IDC = drill 1 square: 1 -5.08,-1.27 | drill 1: 2 -5.08,1.27; 3 -2.54,-1.27; 4 -2.54,1.27; 5 0,-1.27; 6 0,1.27; 7 2.54,-1.27; 8 2.54,1.27; 9 5.08,-1.27; 10 5.08,1.27
HW4-2.0 = drill 0.762 pad 1.27 square: 1 -3,0 | drill 0.762 pad 1.27: 2 -1,0; 3 1,0; 4 3,0
USB-B-MICRO-SMD_MY = smd 1.6 x 0.4: D+ -4.4,0; D- -4.4,-0.65; GND -4.4,1.3; ID -4.4,0.65; VBUS -4.4,-1.3 | drill 0.5 long: SH@1 -1.5,-2.85; SH@2 -1.5,2.85 | smd 1.9 x 1.9: SH@3 -1.5,-1.1; SH@4 -1.5,1.1 | smd 1.8 x 1.6: SH@5 -4.1,-3.4; SH@6 -4.1,3.4 | hole 0.5: -3.8,-2; -3.8,2
2X03_SMT = smd 1.27 x 5.08: 1 -2.54,-3.175; 2 -2.54,3.175; 3 0,-3.175; 4 0,3.175; 5 2.54,-3.175; 6 2.54,3.175
2X8 = drill 1 square: 1 -8.89,-1.27 | drill 1: 2 -8.89,1.27; 3 -6.35,-1.27; 4 -6.35,1.27; 5 -3.81,-1.27; 6 -3.81,1.27; 7 -1.27,-1.27; 8 -1.27,1.27; 9 1.27,-1.27; 10 1.27,1.27; 11 3.81,-1.27; 12 3.81,1.27; 13 6.35,-1.27; 14 6.35,1.27; 15 8.89,-1.27; 16 8.89,1.27
2X04 = drill 1 square: 1 -3.81,-1.27 | drill 1: 2 -3.81,1.27; 3 -1.27,-1.27; 4 -1.27,1.27; 5 1.27,-1.27; 6 1.27,1.27; 7 3.81,-1.27; 8 3.81,1.27
2X08 = drill 1.016 octagon: 1 -8.89,-1.27; 2 -8.89,1.27; 3 -6.35,-1.27; 4 -6.35,1.27; 5 -3.81,-1.27; 6 -3.81,1.27; 7 -1.27,-1.27; 8 -1.27,1.27; 9 1.27,-1.27; 10 1.27,1.27; 11 3.81,-1.27; 12 3.81,1.27; 13 6.35,-1.27; 14 6.35,1.27; 15 8.89,-1.27; 16 8.89,1.27
CHIPLED_0603 = smd 1 x 1: A 0,-0.85; C 0,0.85
R0603 = smd 0.6 x 1: 1 -0.8,0; 2 0.8,0
SNR2-3.0 = drill 0.762 pad 1.397 square: 1 -1.651,0 | drill 0.762 pad 1.397: 2 1.651,0
MICROBUILDER_SOLDERJUMPER_ARROW_NOPASTE = smd 0.762 x 1.524: 1 -1.016,0; 2 1.016,0
MICROBUILDER_SOLDERJUMPER_ARROW_NOPASTE_3 = smd 1.27 x 1.524: 1 0,0 | smd 0.762 x 1.524: 2 2.032,0; 3 -2.032,0
MICROPUSH-BUT_TOP = smd 1.5 x 1: A -4,0; B 4,0 | smd 0.2 x 0.2: SH0 -2.54,1.31
DFN-6-3X3-SI7021 = smd 0.2 x 0.2: 7 0,0 | smd 1.2 x 0.5: DATA 1.7,-1; GND 1.7,0; NC@3 1.7,1; NC@4 -1.7,1; SCK -1.7,-1; VDD -1.7,0
70543-02 = drill 1.016 long: 1 -1.27,0; 2 1.27,0
70543-04 = drill 1.016 square: 1 -3.81,0 | drill 1.016: 2 -1.27,0; 3 1.27,0; 4 3.81,0

### Placement (x,y rotation side)
B101  50.4,40.41 270 top
C101  74.78,37.24 270 bottom
C102  42.14,33.81 270 bottom
C103  86.47,30.25 90 bottom
C104  76.56,40.16 180 top
C105  76.81,42.44 180 bottom
C106  86.47,35.33 270 bottom
C107  67.03,44.98 0 bottom
C108  68.18,39.9 0 top
C109  80.24,33.81 180 bottom
C110  72.37,33.05 90 bottom
C111  84.43,35.33 270 bottom
C112  63.23,36.6 270 bottom
C113  80.12,68.99 270 bottom
C114  66.27,74.32 270 bottom
C115  70.97,59.97 180 bottom
C116  87.61,51.08 270 bottom
C117  78.85,51.08 270 bottom
C201  2.14,77.24 180 top
C202  2.14,79.27 180 top
C203  15.09,55.65 0 top
C204  8.74,4.34 0 top
C205  39.22,1.3 0 top
C206  39.22,16.54 0 top
C207  39.22,18.31 0 top
C208  15.09,53.62 0 top
C209  8.74,7.14 0 top
C301  79.61,5.11 90 top
C302  82.28,5.36 270 bottom
C303  70.72,14.5 180 top
C304  73,17.55 180 bottom
C305  79.61,12.22 90 top
C306  77.32,12.47 90 bottom
C307  67.67,14.5 0 top
D101  58.53,43.84 0 bottom
D102  58.53,41.81 0 bottom
D201  8.74,54.64 270 top
D202  10.77,1.55 0 top
D203  3.41,82.07 0 top
G101  50.4,34.7 0 top
G102  50.4,42.06 270 top
HA101  70.84,81.43 270 top
IC101  51.41,73.94 270 top
IC102  49.76,41.43 90 bottom
IC103  60.56,48.41 90 bottom
IC104  77.7,34.06 270 top
IC105  83.67,33.3 90 top
IC106  61.32,82.83 90 bottom
IC107  61.32,65.81 90 bottom
IC201  8.49,78.26 270 bottom
IC202  7.22,46 270 bottom
IC203  18.14,7.39 180 bottom
IC204  48.87,7.14 180 bottom
IC301  85.45,12.73 270 bottom
IC302  68.94,11.2 180 top
J101  79.61,89.43 180 top
J102  44.05,72.42 90 top
J103  75.54,64.8 270 top
J104  75.54,49.17 90 top
J105  84.43,49.17 90 top
J201  5.69,95.28 90 bottom
J202  14.84,79.02 0 top
J203  6.2,44.22 270 top
J204  18.39,7.65 90 top
J205  48.87,9.42 0 top
J206  34.9,8.41 180 bottom
J207  17.63,19.84 180 top
J208  31.09,79.02 90 top
J209  21.19,46.25 90 top
J301  63.35,10.44 90 top
JP101  85.7,70.64 270 top
LED101  41.51,28.98 270 top
LED102  88.75,42.7 270 top
LED103  84.94,42.7 90 top
LED201  43.54,20.85 270 top
LED202  43.54,18.06 270 top
R101  74.78,29.87 90 bottom
R102  72.37,29.87 270 bottom
R103  77.96,30 180 top
R104  45.06,33.3 180 bottom
R105  41.38,39.52 0 bottom
R106  69.19,49.56 90 bottom
R107  75.67,33.81 180 bottom
R108  68.81,74.32 270 bottom
R109  67.42,36.6 90 bottom
R110  61.7,73.94 180 bottom
R111  85.7,39.14 270 bottom
R112  65.51,36.6 270 bottom
R113  58.53,36.73 0 bottom
R114  58.53,38.63 0 bottom
R201  6.46,56.16 90 top
R202  15.09,51.33 0 top
R203  39.22,20.85 0 top
R204  39.22,3.33 180 top
R205  39.22,14.5 0 top
R206  14.08,41.43 270 top
R207  47.35,20.85 180 top
R208  47.35,18.06 180 top
R209  54.21,16.79 270 top
R301  69.7,17.55 0 bottom
R302  67.67,2.82 90 top
R303  70.72,2.82 90 top
SJ101  64.11,86.89 90 top
SJ102  59.29,33.68 90 bottom
SJ103  63.61,69.62 90 top
SJ104  69.7,69.88 90 top
SJ201  12.55,23.39 0 bottom
SJ202  24.74,51.33 90 bottom
SJ203  24.74,46.51 90 bottom
SJ301  74.27,3.07 270 top
SW101  71.48,32.03 90 top
SW102  64.88,31.9 90 top
U101  83.42,38.38 0 top
U301  68.94,6.63 0 top
X101  69.45,91.72 180 top
X102  66.4,51.59 90 top
X103  89.01,32.79 270 top
X301  86.47,5.11 90 top
X302  67.92,20.09 180 top
X303  83.93,20.09 180 top

### Tracks (layer width: path | path; a pad name or v marks a point on that pad's centre or on a via)
1EN  (via drill 0.38)
  Top 0.203: J202.1 12.3,74.45 7.22,74.45 v6.96,74.19
  Bottom 0.203: J208.1 30.84,62.26 29.06,62.26 28.3,63.02 3.15,63.02 2.49,63.68 IC201.RST 2.49,73.27 3.41,74.19 v6.96,74.19
1I037  (via drill 0.38)
  Top 0.203: J208.11 31.09,77.75 28.3,77.75 18.39,67.84 17.63,67.84 17.5,67.72 v17.5,67.59
  Bottom 0.203: IC201.I37 17.49,67.61 v17.5,67.59
1IO0  (via drill 0.38)
  Top 0.203: J202.6 18.52,82.19 v18.65,82.07
  Bottom 0.203: IC201.I00 3.99,86.2 3.66,85.88 3.66,84.86 4.17,84.35 4.68,84.35 5.19,83.85 17.12,83.85 18.65,82.32 | J208.2 24.49,69.11 24.49,70.38 24.24,70.64 22.71,70.64 21.44,71.91 21.44,79.53 18.65,82.32 | v18.65,82.07 18.65,82.32
1IO1  (via drill 0.38)
  Top 0.203: J208.9 31.09,75.21 27.28,75.21 26.27,74.19 v26.27,73.94 | v26.14,79.66 23.86,79.66 v22.71,80.8
  Bottom 0.203: IC201.I01 5.49,86.08 5.69,85.88 6.2,85.88 6.71,85.37 17.89,85.37 22.46,80.8 v22.71,80.8 | v26.14,79.66 26.52,79.27 26.52,74.19 v26.27,73.94
1IO2  (via drill 0.38)
  Top 0.203: v26.78,80.54 21.19,86.13 10.01,86.13 v6.96,89.18 | J208.10 27.79,73.94 v26.78,72.92
  Bottom 0.203: IC201.I02 6.99,89.16 v6.96,89.18 | v26.78,80.54 27.03,80.29 27.03,73.18 v26.78,72.92
1IO3  (via drill 0.38)
  Top 0.203: v8.49,89.18 11.03,86.64 21.32,86.64 25.38,82.58 26.52,82.58 v27.03,82.07
  Bottom 0.203: IC201.I03 v8.49,89.18 | J208.5 31.09,70.13 28.81,70.13 27.54,71.4 27.54,81.56 v27.03,82.07
1IO4  (via drill 0.38)
  Top 0.203: v28.55,83.08 25.51,83.08 21.44,87.15 12.04,87.15 v10.01,89.18
  Bottom 0.203: IC201.I04 9.99,89.16 v10.01,89.18 | J208.7 31.09,72.67 28.81,72.67 28.55,72.92 v28.55,83.08
1IO5
  Bottom 0.203: IC201.I05 11.49,92.69 13.06,94.26 J208.26
1IO6  (via drill 0.38)
  Top 0.203: v12.81,89.18 14.33,87.66 21.57,87.66 25.63,83.59 28.05,83.59 28.55,84.1 J208.18
  Bottom 0.203: IC201.I06 12.99,89 v12.81,89.18
1IO7  (via drill 0.38)
  Top 0.203: v14.58,89.18 20.68,89.18 25.76,84.1 27.79,84.1 29.06,85.37 31.09,85.37 J208.17
  Bottom 0.203: IC201.I07 14.49,89.08 v14.58,89.18
1IO8  (via drill 0.38)
  Top 0.203: v16.11,89.94 16.36,89.69 20.81,89.69 25.63,84.86 v26.52,84.86
  Bottom 0.203: IC201.I08 15.99,89.82 v16.11,89.94 | v26.52,84.86 27.03,85.37 30.33,85.37 31.09,84.61 31.09,80.29 J208.13
1IO9
  Bottom 0.203: IC201.I09 17.49,92.59 18.14,93.24 28.81,93.24 29.06,92.99 31.09,92.99 J208.25
1IO10
  Bottom 0.203: IC201.I10 18.99,91.81 19.41,92.23 26.78,92.23 J208.22
1IO11  (via drill 0.38)
  Top 0.203: v20.43,90.96 20.43,91.72 21.7,92.99 31.09,92.99 J208.23
  Bottom 0.203: IC201.I11 20.49,90.9 v20.43,90.96
1IO12  (via drill 0.38)
  Top 0.203: v22.2,89.94 22.2,90.96 23.22,91.97 29.57,91.97 J208.24
  Bottom 0.203: IC201.I12 21.99,89.73 v22.2,89.94
1IO13  (via drill 0.38)
  Top 0.203: v25,87.66 28.81,87.66 J208.20
  Bottom 0.203: IC201.I13 24.6,87.26 v25,87.66
1IO14
  Bottom 0.203: IC201.I14 24.38,85.01 27.28,87.91 31.09,87.91 J208.21
1IO15
  Bottom 0.203: IC201.I15 27.11,83.51 28.05,82.58 28.05,72.16 28.81,71.4 J208.8
1IO19  (via drill 0.38)
  Top 0.203: v4.42,85.12 4.93,85.62 v4.93,89.18
  Bottom 0.203: v4.42,85.12 4.68,85.37 5.95,85.37 6.46,84.86 17.63,84.86 22.46,80.04 22.46,79.02 23.97,77.51 IC201.I19
  Bottom 0.305: J201.D- 5.04,89.29 v4.93,89.18
1IO20  (via drill 0.38)
  Top 0.203: v5.95,88.93 5.44,88.42 5.44,84.86 v5.69,84.61
  Bottom 0.203: v5.69,84.61 5.95,84.35 17.38,84.35 21.95,79.78 21.95,78 23.95,76.01 IC201.I20
  Bottom 0.305: J201.D+ 5.69,89.18 v5.95,88.93
1IO34  (via drill 0.38)
  Top 0.203: J208.12 27.79,76.48 21.95,70.64 v21.95,67.59
  Bottom 0.203: IC201.I34 21.99,67.63 v21.95,67.59
1IO36  (via drill 0.38)
  Top 0.203: v18.9,71.91 19.41,71.91 28.55,81.05 28.55,81.81 29.57,82.83 32.87,82.83 33.63,83.59 33.63,85.37 J208.19
  Bottom 0.203: IC201.I36 18.99,71.82 v18.9,71.91
1IO39  (via drill 0.38)
  Top 0.203: v14.58,67.59 15.35,68.35 18.14,68.35 28.81,79.02 J208.14
  Bottom 0.203: IC201.I39 14.49,67.69 v14.58,67.59
1IO40  (via drill 0.38)
  Top 0.203: J208.15 31.09,80.29 29.32,80.29 17.89,68.86 14.33,68.86 v13.06,67.59
  Bottom 0.203: IC201.I40 12.99,67.66 v13.06,67.59
1IO41  (via drill 0.38)
  Top 0.203: J208.16 17.63,69.37 13.31,69.37 v11.54,67.59
  Bottom 0.203: IC201.I41 11.49,67.64 v11.54,67.59
1RX0  (via drill 0.38)
  Top 0.203: v18.65,75.72 17.5,75.72 J202.5
  Bottom 0.203: IC201.RX 6.99,69.9 7.98,70.89 7.98,72.67 8.74,73.43 16.36,73.43 v18.65,75.72
1TX0  (via drill 0.38)
  Top 0.203: v14.84,72.67 J202.3 | J202.3 14.84,76.23 15.09,76.48 15.09,76.1 J202.3
  Bottom 0.203: IC201.TX 8.49,72.42 9,72.92 14.58,72.92 v14.84,72.67
2D+
  Bottom 0.406: J206.D+ 29.06,8.41 28.45,7.79 IC203.IO19
2D-
  Bottom 0.406: J206.D- 28.67,9.06 28.43,9.29 IC203.IO18
2EN  (via drill 0.38)
  Top 0.203: J207.1 28.55,19.08 28.55,3.84 28.05,3.33 v20.93,3.33 20.93,4.47 J204.1
  Bottom 0.203: IC203.EN 20.9,3.29 v20.93,3.33
2IO0
  Bottom 0.203: IC203.IO0 26.03,1.79 18.9,8.92 J207.8
2IO1
  Bottom 0.203: IC203.IO1 25.29,3.29 19.41,9.17 19.41,17.55 20.17,18.31 20.17,19.84 J207.7
2IO2  (via drill 0.38)
  Top 0.203: v20.17,17.3 20.17,19.84 J207.5
  Bottom 0.203: IC203.IO2 24.55,4.79 19.92,9.42 19.92,17.04 v20.17,17.3
2IO3  (via drill 0.38)
  Top 0.203: J207.12 16.11,16.28 v20.68,16.28
  Bottom 0.203: IC203.IO3 23.81,6.29 20.43,9.68 20.43,16.03 v20.68,16.28
2IO4  (via drill 0.38)
  Top 0.203: v11.28,8.53 v11.28,5.49
  Bottom 0.203: IC203.IO4 10.59,4.79 v11.28,5.49 | v11.28,8.53 12.68,8.53 13.57,9.42 13.57,16.54 15.09,18.06 15.09,19.08 14.33,19.84 13.57,19.84 12.55,20.85 SJ201.1
2IO5
  Bottom 0.203: IC203.IO5 13.99,6.29 14.58,6.88 14.58,15.27 17.63,18.31 17.63,19.84 J207.9
2IO6
  Bottom 0.203: J207.10 14.08,16.28 14.08,9.17 12.7,7.79 IC203.IO6
2IO7
  Bottom 0.203: IC203.IO7 12.67,9.29 13.06,9.68 13.06,17.55 12.55,18.06 12.55,18.82 11.54,19.84 10.01,19.84 J207.16
2IO8
  Bottom 0.203: IC203.IO8 12.4,10.79 12.55,10.95 12.55,17.3 J207.14
2IO9  (via drill 0.38)
  Top 0.203: v11.54,12.22 15.35,12.22 | 15.35,12.22 23.09,12.22 26.52,15.65 J207.2 | J204.6 15.22,12.09 15.35,12.22
  Bottom 0.203: IC203.IO9 11.46,12.29 v11.54,12.22
2IO10  (via drill 0.38)
  Top 0.203: J207.15 10.01,19.84 11.54,19.84 12.55,18.82 12.55,18.31 15.6,15.27 v21.7,15.27
  Bottom 0.203: IC203.IO10 23.17,13.79 v21.7,15.27
2RX0  (via drill 0.38)
  Top 0.61: J204.5 22.71,10.19 v23.98,11.46
  Bottom 0.203: IC203.RX0 24.82,12.29 v23.98,11.46
2TX0  (via drill 0.38)
  Top 0.203: J204.3 24.49,7.65 v24.74,7.65
  Bottom 0.203: IC203.TX0 25.35,10.79 24.74,10.19 v24.74,7.65
3ADC  (via drill 0.38)
  Top 0.203: J209.7 21.19,43.71 17.12,43.71 16.11,44.73 v14.58,44.73 | R202.1 13.82,51.33 v13.31,50.83
  Bottom 0.203: IC202.ADC 3.42,51.32 3.92,50.83 v13.31,50.83 14.84,49.3 14.84,44.98 v14.58,44.73
3EN  (via drill 0.38)
  Top 0.203: J209.1 21.19,38.63 4.17,38.63 v2.65,40.16 | J203.1 1.38,46.76 v1.38,48.54
  Bottom 0.203: IC202.RESET 1.42,48.58 v1.38,48.54 2.65,47.27 v2.65,40.16
3IO0  (via drill 0.38)
  Top 0.203: J203.6 9.38,40.03 v9.5,39.9
  Bottom 0.203: J209.2 18.39,35.84 10.01,35.84 9.42,36.43 IC202.GPIO0 9.42,39.82 v9.5,39.9
3IO2
  Bottom 0.203: IC202.GPIO2 11.42,39.02 15.35,42.95 15.35,49.3 16.62,50.57 18.65,50.57 19.41,51.33 20.93,51.33 | 20.93,51.33 SJ202.1 | SJ203.2 24.24,47.52 22.97,48.79 22.2,48.79 21.19,49.81 21.19,51.08 20.93,51.33
3IO4  (via drill 0.38)
  Top 0.203: v14.08,46.25 21.19,46.25 J209.9
  Bottom 0.203: v14.08,46.25 7.42,39.6 IC202.GPIO4
3IO5  (via drill 0.38)
  Top 0.203: J209.10 14.84,47.52 v13.57,48.79
  Bottom 0.203: IC202.GPIO5 5.42,39.63 13.31,47.52 13.57,47.78 v13.57,48.79
3IO12  (via drill 0.38)
  Top 0.203: J209.5 21.19,41.17 17.89,41.17 15.6,43.46 13.57,43.46 12.81,44.22 12.81,47.78 11.79,48.79 11.79,55.4 v11.28,55.91
  Bottom 0.203: v11.28,55.91 11.28,54.38 11.36,54.3 IC202.GPIO12
3IO13
  Bottom 0.203: J209.16 18.9,56.16 13.82,56.16 13.42,55.76 IC202.GPIO13
3IO14
  Bottom 0.203: J209.15 20.43,57.18 10.01,57.18 9.42,56.58 IC202.GPIO14
3IO15  (via drill 0.38)
  Top 0.203: R206.2 15.13,40.63 v15.35,40.41
  Bottom 0.203: J209.12 16.87,50.06 15.85,49.05 15.85,40.92 v15.35,40.41 14.84,40.41 13.42,38.99 IC202.GPIO15
3IO16
  Bottom 0.203: 7.47,54.25 7.47,52.86 8.23,52.1 19.41,52.1 J209.14
  Bottom 0.254: 7.47,54.25 IC202.GPIO16
3RX0  (via drill 0.38)
  Top 0.254: v3.92,40.41 3.92,40.79 J203.5
  Bottom 0.254: IC202.RXD0 3.42,39.91 v3.92,40.41
3TX0  (via drill 0.38)
  Top 0.254: v1.12,42.95 1.12,43.97 1.38,44.22 J203.3
  Bottom 0.254: IC202.TXD0 1.42,42.66 v1.12,42.95
4EN  (via drill 0.38)
  Top 0.61: R203.1 38.42,19.62 v38.46,19.58 | C205.2 v42.27,1.3
  Bottom 0.61: IC204.RESET 42.23,1.34 v42.27,1.3 44.56,1.3 45.83,2.57 45.83,16.03 42.27,19.58 v38.46,19.58
4IO0  (via drill 0.38)
  Top 0.61: R208.1 v49.38,18.06
  Bottom 0.61: IC204.GPIO0 54.8,9.34 49.38,14.76 v49.38,18.06
4IO2  (via drill 0.38)
  Top 0.61: R207.1 v49.38,20.85
  Bottom 0.61: IC204.GPIO2 55.09,11.34 51.16,15.27 51.16,19.08 v49.38,20.85
4IO12  (via drill 0.38)
  Top 0.61: v42.52,11.46 42.52,9.68 42.78,9.42 51.16,9.42 51.41,9.17 J205.5
  Bottom 0.61: IC204.GPIO12 42.41,11.34 v42.52,11.46
4IO14  (via drill 0.38)
  Top 0.61: J205.2 46.33,10.69 46.08,10.44 v44.3,10.44
  Bottom 0.61: IC204.GPIO14 43.2,9.34 v44.3,10.44
4IO15  (via drill 0.38)
  Top 0.61: v54.21,14.5 R209.2
  Bottom 0.61: IC204.GPIO15 55.37,13.34 v54.21,14.5
4RX0  (via drill 0.38)
  Top 0.61: J205.3 v48.87,2.82
  Bottom 0.61: IC204.RXD0 55.21,3.34 54.21,4.34 50.4,4.34 v48.87,2.82
4TX0  (via drill 0.38)
  Top 0.61: J205.1 46.33,1.8 v46.84,1.3
  Bottom 0.61: IC204.TXD0 46.88,1.34 v46.84,1.3
+3V3  (via drill 0.38)
  Top 0.305: IC105.8 84.87,31.53 v84.66,31.32 | IC105.6 86.16,33.62 v86.44,33.35 | IC104.1 76.2,35.18 76,35.38 v75.01,35.38 | U101.VDD 80.88,38.38 80.62,38.63 80.62,49.67 81.13,50.17 J105.3
  Top 0.61: J104.3 69.05,50.17 66.65,47.78 X102.1 62.59,51.59 62.59,66.57 SJ103.3 | LED101.A 40.66,31 v40.72,31.06
  Bottom 0.61: J104.3 78.85,50.17 | 78.85,50.17 J105.3 87.5,50.17 C116.2 | C106.2 86.47,33.38 v86.44,33.35 86.44,31.08 C103.2 86.2,31.32 v84.66,31.32 84.43,31.54 C111.2 82.95,34.53 81.89,35.59 | C117.2 78.85,50.17 | 45.83,31.01 59.54,31.01 | 59.54,31.01 61.07,31.01 61.07,43.97 | SJ102.1 59.29,31.27 59.54,31.01 | R104.2 45.86,31.05 45.83,31.01 | 61.07,48.41 IC103.2 55.86,48.41 52.18,52.1 52.18,54.38 46.84,59.72 J102.3 | 61.07,48.41 IC103.4 65.77,48.41 X102.1 69.19,47.78 69.45,47.52 | 61.07,43.97 61.07,48.41 | 69.45,44.98 C108.1 69.45,37.36 | 69.45,44.98 69.45,47.52 | 69.45,47.52 69.45,48.5 R106.1 | 69.45,37.36 69.45,34.82 70.43,33.85 C110.2 74.83,33.85 R107.1 74.78,33.81 | R101.2 74.78,33.81 | 74.78,33.81 74.78,35.33 | 74.78,35.33 C101.2 | 74.78,35.33 74.83,35.38 v75.01,35.38 75.21,35.59 81.89,35.59 | D101.A 60.94,43.84 61.07,43.97 | 69.45,37.36 69.41,37.4 R109.2 R112.1 | 81.89,35.59 81.89,37.87 82.36,38.34 R111.2 88.28,38.34 89.01,37.62 X103.1 | C107.1 69.45,44.98 | 45.83,31.01 40.77,31.01 v40.72,31.06 40.26,31.52 40.24,31.52 40.24,34.06 40.78,34.61 C102.1 42.14,37.49 42.91,38.25 IC102.2
+3V3_1  (via drill 0.38)
  Top 0.61: J208.4 26.27,62.76 6.71,62.76 1.38,68.1 v1.38,75.46 1.51,75.6 1.51,77.24 | D203.C 1.51,79.27 | 1.51,79.27 1.51,77.24 | C201.2 1.51,77.24 | C202.2 1.51,79.27
  Bottom 0.61: IC201.VCC 2.49,76.58 v1.38,75.46
+3V3_2  (via drill 0.38)
  Top 0.61: J207.4 23.98,15.01 22.71,13.74 11.03,13.74 9.54,12.26 C209.2 C204.2 9.54,1.55 v11.28,1.55 D202.C
  Bottom 0.61: IC203.3V3 11.04,1.79 v11.28,1.55
+3V3_3  (via drill 0.38)
  Top 0.61: v17.38,54.13 17.38,53.62 | 17.38,53.62 v17.38,48.79 | 17.38,53.62 C208.2 C203.2 15.89,56.63 15.56,56.96 8.74,56.96 | R201.2 8.74,56.96 | D201.C 8.74,56.96
  Bottom 0.61: v17.38,48.79 17.38,40.41 17.89,39.9 J209.4 | IC202.VCC 17.21,54.3 v17.38,54.13
+3V3_4  (via drill 0.38)
  Top 0.61: R205.2 40.02,15.52 | 40.02,15.52 C206.2 C207.2 R203.2 LED201.A LED202.A | 40.02,15.52 v42.27,15.52 43.03,16.28 50.91,16.28 51.41,15.77 J205.6
  Bottom 0.61: IC204.VCC 42.09,15.34 v42.27,15.52
+3V3_S  (via drill 0.38)
  Top 0.406: IC302.6 68.61,14.36 C307.2 | IC302.8 C303.2 | U301.VDD J301.1
  Top 0.61: SJ301.1 v74.27,5.61 | C303.2 69.92,15.48 v70.21,15.77 | C307.2 68.47,15.74 v68.43,15.77
  Bottom 0.61: IC301.2 85.96,12.73 | 85.96,12.73 IC301.4 79.61,12.73 | C305.1 79.61,12.73 | 85.96,12.73 85.96,18.31 X303.1 | 79.61,12.73 77.32,12.73 | 77.32,12.73 74.02,12.73 | 74.02,12.73 73,12.73 71.73,14 71.73,15.77 | C306.2 77.32,12.73 | 74.02,12.73 74.27,12.47 v74.27,5.61 74.27,3.58 73.77,3.07 66.15,3.07 64.88,4.34 64.88,6.38 J301.1 | 71.73,15.77 v70.21,15.77 v68.43,15.77 | X302.1 71.73,17.55 | 71.73,17.55 71.73,15.77 | R301.1 71.73,17.55 | 71.73,17.55 C304.1
+5V  (via drill 0.38)
  Top 0.61: SJ101.2 67.42,87.91 68.18,88.67 X101.2 | v74.53,43.46 66.91,43.46 60.05,50.32 IC101.OUT+ 60.05,71.4 | 60.05,71.4 60.05,81.31 v62.59,83.85 | SJ103.2 60.3,71.65 60.05,71.4
  Bottom 0.61: C104.1 75.29,42.44 | 75.29,42.44 75.29,42.7 v74.53,43.46 | C105.1 75.29,42.44 | v62.59,83.85 62.59,90.96 63.1,91.47 67.92,91.47 X101.2 | 57.76,54.13 54.72,54.13 46.59,62.26 J102.5 | 57.76,54.13 IC101.OUT+ | IC103.3 57.46,53.82 57.76,54.13
+5V_1  (via drill 0.38)
  Top 0.61: J208.6 29.32,68.86 24.74,64.29 7.73,64.29 4.68,67.34 4.68,79.78 3.41,81.05 3.41,83.59 2.9,84.1 v2.9,89.43
  Bottom 0.406: J201.VBUS 4.39,90.42 3.41,89.43 v2.9,89.43
+5V_2
  Bottom 0.406: J206.VBUS 29.54,9.71 29.32,9.93
  Bottom 0.61: J207.6 23.98,16.03 28.81,16.03 29.32,15.52 29.32,9.93
+5V_S
  Bottom 0.61: 82.4,6.38 X301.2 88.55,8.46 IC301.3 | 82.4,6.38 C301.1 79.1,6.38 74.27,1.55 65.64,1.55 63.35,3.84 63.35,7.9 J301.3 | C302.1 82.28,6.25 82.4,6.38
+12V
  Top 0.61: J101.3 76.56,89.43 75.8,88.67 70.46,88.67 67.67,85.88 | 67.67,85.88 SJ101.1 60.05,85.88 IC101.IN+ | 67.67,85.88 67.67,76.73 69.7,74.7 SJ104.2
A(CS_CLK)
  Bottom 0.203: IC107.18 71.86,62.64 73.51,60.99 74.78,60.99 76.05,62.26 J103.8 83.93,69.37 JP101.9
B(CS)
  Top 0.203: JP101.10 88.5,69.37 89.26,68.61 89.26,60.73 88.5,59.97 78.85,59.97 77.83,60.99 75.54,60.99 J103.7
  Bottom 0.203: IC107.17 72.62,63.91 J103.7
BLUE1  (via drill 0.38)
  Top 0.203: v80.62,81.81 80.62,79.27 82.91,76.99 JP101.3
  Bottom 0.203: v80.62,81.81 80.37,81.56 77.45,81.56 76.69,82.32 67.92,82.32 67.8,82.19 IC106.16
BLUE2  (via drill 0.38)
  Top 0.203: v74.02,84.86 v74.02,79.02
  Bottom 0.203: IC106.13 67.54,86 69.07,87.53 71.86,87.53 74.02,85.37 v74.02,84.86 | 81.89,74.45 82.15,74.19 | 82.15,74.19 JP101.7 | v74.02,79.02 77.32,79.02 82.15,74.19
BUZ
  Bottom 0.406: R108.1 68.81,76.36 HA101.A
BUZZER
  Bottom 0.406: IC107.11 67.29,71.53 68.81,73.05 R108.2
C(LOCK)  (via drill 0.38)
  Top 0.203: v69.45,65.18 69.45,60.99 72.24,58.19 75.29,58.19 J103.10
  Bottom 0.203: JP101.11 83.93,66.83 J103.10 | IC107.16 v69.45,65.18
CLOCK  (via drill 0.38)
  Top 0.203: JP101.13 82.91,64.29 80.88,66.32 80.88,74.45 76.56,78.77 76.56,83.59 v75.54,84.61
  Bottom 0.203: IC106.12 67.54,87.28 68.31,88.04 72.62,88.04 75.54,85.12 v75.54,84.61
COM_VCC2
  Top 0.61: D201.A 8.74,47.4 J203.2
D(ATA)  (via drill 0.38)
  Top 0.203: v70.97,66.07 70.97,60.99 72.24,59.72 J103.9
  Bottom 0.203: J103.9 75.54,60.99 77.32,60.99 77.96,61.62 77.96,62.13 83.93,68.1 85.7,68.1 JP101.12 | IC107.15 70.59,66.45 v70.97,66.07
E
  Bottom 0.203: JP101.8 85.7,70.64 82.91,70.64 81.89,71.65 73,71.65 69.07,67.72 IC107.14
GND
  Bottom 0.203: IC201.PAD3 7.39,80.97 6.96,80.54 6.96,79.68 IC201.PAD4
  pour Top: 91,0 91,96 0,96 0,0
  pour Bottom: 91,0 91,96 0,96 0,0
GREEN1
  Bottom 0.203: JP101.2 85.45,81.05 77.32,81.05 76.56,81.81 68.18,81.81 67.29,80.92 IC106.17
GREEN2  (via drill 0.38)
  Top 0.203: v77.83,82.83 77.83,79.02 83.67,73.18 85.7,73.18 JP101.6
  Bottom 0.203: IC106.14 67.29,84.73 68.69,83.34 77.32,83.34 v77.83,82.83
I2C_SCL  (via drill 0.38)
  Top 0.203: v49.38,54.89 53.19,54.89 55.48,57.18 v55.48,57.68
  Top 0.305: IC104.6 80.88,34.56 | 80.88,34.56 81.13,34.56 81.42,34.27 IC105.4 | 80.88,34.56 80.96,34.64 80.96,37.3 80.88,37.38 | U101.SCK 80.88,37.38 | J104.1 79.1,46.17 79.61,45.67 79.61,37.38 | X103.4 83.67,28.98 80.88,31.78 76.05,31.78 73.77,34.06 73.77,36.6 74.54,37.38 79.61,37.38 | 80.88,37.38 79.61,37.38
  Bottom 0.203: IC102.16 52.05,36.98 47.35,41.68 47.35,53.87 48.37,54.89 v49.38,54.89 | J104.1 75.37,46.17 73,48.54 73,51.84 67.16,57.68 v55.48,57.68 55.22,57.68 45.57,67.34 J102.9
  Bottom 0.406: IC102.16 57.47,36.98 R113.2
  Bottom 0.61: J104.1 J105.1
I2C_SCL_S  (via drill 0.38)
  Top 0.406: R302.2 67.67,4.85 | 67.67,4.85 67.67,5.2 U301.SCK | v74.53,14.25 v71.73,11.46 | v66.91,4.6 67.42,4.6 67.67,4.85 | IC302.4 67.74,10 v67.16,9.42
  Bottom 0.406: X303.4 80.12,19.84 v74.53,14.25 | v66.91,4.6 67.16,4.85 v67.16,9.42 67.16,11.46 | 67.16,11.46 67.16,11.71 J301.7 | v71.73,11.46 67.16,11.46
I2C_SDA  (via drill 0.38)
  Top 0.203: v49.13,53.37 50.14,54.38 53.45,54.38 56.24,57.18 v56.24,58.45
  Top 0.305: IC104.4 81.38,33.56 81.39,33.55 81.46,33.62 IC105.3 83.49,33.62 83.67,33.81 83.67,35.08 85.12,36.52 U101.DATA 86.96,37.38 86.97,37.36 | J105.2 83.42,48.17 82.66,47.41 82.66,40.92 82.91,40.67 86.47,40.67 86.97,40.16 86.97,37.36 | X103.2 88.24,34.06 86.97,35.33 86.97,37.36
  Bottom 0.203: IC102.15 52.05,38.25 48.37,41.94 48.37,52.6 v49.13,53.37 | J104.2 74.13,48.17 73.51,48.79 73.51,51.97 67.29,58.19 56.49,58.19 v56.24,58.45 55.22,58.45 46.59,67.08 46.59,67.84 45.83,68.61 44.05,68.61 J102.10
  Bottom 0.406: IC102.15 57.34,38.25 R114.2
  Bottom 0.61: J105.2 J104.2
I2C_SDA_S  (via drill 0.38)
  Top 0.406: R303.2 70.72,5.55 70.66,5.61 | v72.75,5.61 70.66,5.61 | 70.66,5.61 U301.DATA | 72.75,8.66 68.69,8.66 68.61,8.73 IC302.3 68.61,11.02 68.43,11.2 66.91,11.2 65.13,12.98 63.35,12.98 J301.8 | v72.75,8.15 72.75,8.66 | 72.75,8.66 72.75,9.93 80.12,17.3 82.4,17.3 X303.2
  Bottom 0.406: v72.75,8.15 v72.75,5.61
IN2_A
  Bottom 0.203: SJ201.2 10.52,21.87 J207.13
IN3_DHT
  Bottom 0.203: J209.8 21.19,43.71 22.97,43.71 SJ203.1
IN_A
  Bottom 0.203: J102.14 44.05,71.15 45.83,71.15 55.61,61.37 IC107.2
IN_B
  Bottom 0.203: IC107.3 55.1,62.64 J102.13
IN_BLUE1
  Bottom 0.203: IC106.4 45.95,80.92 45.57,81.31 44.05,81.31 J102.22
IN_BLUE2
  Bottom 0.203: IC106.7 45.7,84.73 J102.23
IN_BUZZER  (via drill 0.38)
  Top 0.203: J102.11 46.08,70.64 v54.21,70.64
  Bottom 0.203: IC107.9 54.59,70.26 v54.21,70.64
IN_C
  Bottom 0.203: J102.16 44.05,73.69 45.83,73.69 55.61,63.91 IC107.4
IN_CLOCK
  Bottom 0.203: IC106.8 45.95,86 45.57,86.39 44.05,86.39 J102.26
IN_D
  Bottom 0.203: IC107.5 55.1,65.18 J102.15
IN_DHT
  Bottom 0.203: X102.2 64.62,52.1 64.62,53.62 61.83,56.41 54.46,56.41 46.08,64.8 J102.7
  Bottom 0.61: X102.2 69.16,50.32 R106.2
IN_DHT_S
  Bottom 0.406: R301.2 68.9,17.26 64.08,17.26 63.35,16.54 63.35,12.98 J301.5
  Bottom 0.61: R301.2 68.9,19.8 X302.2
IN_E
  Bottom 0.203: J102.18 44.05,76.23 45.83,76.23 46.59,75.46 46.59,74.45 54.59,66.45 IC107.6
IN_GREEN1
  Bottom 0.203: IC106.3 45.7,79.66 J102.19
IN_GREEN2
  Bottom 0.203: IC106.6 45.95,83.47 45.57,83.85 44.05,83.85 J102.24
IN_LATCH
  Bottom 0.203: IC106.9 45.7,87.28 J102.25
IN_LED  (via drill 0.38)
  Top 0.203: J102.12 44.05,68.61 52.68,68.61 v53.45,69.37
  Bottom 0.203: IC107.8 53.83,68.99 v53.45,69.37
IN_OE
  Bottom 0.203: IC107.7 54.08,67.72 47.1,74.7 47.1,75.72 J102.17
IN_RED1
  Bottom 0.203: IC106.2 46.97,78.38 46.59,78.77 44.05,78.77 J102.20
IN_RED2
  Bottom 0.203: IC106.5 45.7,82.19 J102.21
LATCH
  Bottom 0.203: IC106.11 73.38,88.55 77.58,84.35 84.69,84.35 89.26,79.78 89.26,66.57 JP101.14
LED
  Bottom 0.406: R110.2 62.5,70.38 62.63,70.26 IC107.12
N$1
  Bottom 0.61: D101.C D102.C 57.51,41.79 57.51,40.92 56.11,39.52 IC102.14
N$2  (via drill 0.38)
  Top 0.305: LED103.A 85.79,43.88 v85.7,43.97
  Bottom 0.61: v85.7,43.97 R111.1
N$3
  Top 0.61: R302.1 R303.1 74.24,2.02 SJ301.2
N$4
  Top 0.61: D203.A 12.17,82.07 J202.2
N$5  (via drill 0.38)
  Top 0.305: LED102.A 87.9,54.47 86.47,55.91
  Top 0.406: 86.47,55.91 70.46,55.91 v64.11,62.26
  Bottom 0.406: R110.1 60.9,65.47 v64.11,62.26
N$6  (via drill 0.38)
  Top 0.254: R201.1 6.46,53.37 v5.44,52.35
  Bottom 0.203: 5.44,54.32 IC202.CH_PD
  Bottom 0.254: 5.44,54.32 v5.44,52.35
N$7  (via drill 0.38)
  Top 0.61: LED101.C 42.36,36.13 v40.62,37.87
  Bottom 0.61: R105.2 40.58,37.91 v40.62,37.87
N$8
  Top 0.61: J204.2 13.31,5.11 12.67,4.47 D202.A
N$9  (via drill 0.38)
  Top 0.61: R205.1 38.42,5.65 v38.71,5.36
  Bottom 0.61: IC204.CH_PD 38.74,5.34 v38.71,5.36
N$10  (via drill 0.38)
  Top 0.61: v42.27,3.33 R204.1
  Bottom 0.61: IC204.ADC v42.26,3.34 v42.27,3.33
N$11
  Top 0.61: R208.2 LED202.C
N$12
  Top 0.61: R207.2 LED201.C
N$13
  Bottom 0.203: J209.13 23.98,52.6 SJ202.2
N$14
  Bottom 0.203: J209.11 23.98,50.06 SJ202.3
N$15
  Bottom 0.203: SJ201.3 14.58,21.87 J207.11
N$25  (via drill 0.38)
  Top 0.305: IC104.5 78.31,34.06 v77.98,33.74
  Bottom 0.61: C109.1 78.05,33.81 v77.98,33.74 77.92,33.81 R107.2
N$32
  Bottom 0.61: R104.1 44.26,36.08 IC102.1
N$39
  Bottom 0.406: R114.1 R113.1 59.33,34.73 SJ102.2
N$52  (via drill 0.38)
  Top 0.61: B101.+ G101.+ 52.4,34.4 G102.P1"+" 52.4,39.87 52.94,40.41 v59.54,40.41
  Bottom 0.61: D102.A 59.53,40.43 v59.54,40.41
OE  (via drill 0.38)
  Top 0.203: JP101.15 83.42,61.75 79.61,65.56 v79.61,72.92
  Bottom 0.203: v79.61,72.92 72.75,72.92 68.81,68.99 IC107.13
PHOTO_RES
  Top 0.203: R103.2 66.65,30 62.34,34.32 62.34,40.16 60.81,41.68 48.11,41.68 46.84,42.95 46.84,50.57 46.08,51.33 41.25,51.33 40.24,52.35 40.24,62.26 J102.8
  Bottom 0.61: R102.2 R101.1 75.38,29.07 R103.2
PRG_BTN  (via drill 0.38)
  Top 0.203: 67.61,36.03 67.61,36.41 | 67.92,36.03 61.26,42.7 48.62,42.7 47.86,43.46 47.86,54.64 J102.1
  Top 0.61: SW101.B 67.92,36.03 67.61,36.03 67.42,35.84 v67.42,34.32
  Bottom 0.61: v67.42,34.32 R109.1
RED1
  Bottom 0.203: IC106.18 67.29,79.66 68.94,81.31 76.43,81.31 77.19,80.54 83.42,80.54 JP101.1
RED2  (via drill 0.38)
  Top 0.203: v79.23,82.32 79.23,79.15 83.93,74.45 JP101.5
  Bottom 0.203: IC106.15 67.8,83.47 68.43,82.83 76.81,82.83 77.58,82.07 78.97,82.07 v79.23,82.32
RET
  cutout Bottom: 90.53,24.66 60.3,24.66 60.3,1.3 59.03,1.3 59.03,24.66 37.19,24.66 37.19,1.04 35.67,1.04 35.67,29.24 1.38,29.24 1.38,31.52 37.19,31.52 37.19,59.72 0.61,59.72 0.61,61.24 37.19,61.24 37.19,94.51 38.46,94.51 38.46,26.44 90.53,26.44
  cutout Top: 90.53,24.66 60.3,24.66 60.3,1.3 59.03,1.3 59.03,24.66 37.19,24.66 37.19,1.04 35.67,1.04 35.67,29.24 1.38,29.24 1.38,31.52 37.19,31.52 37.19,59.72 0.61,59.72 0.61,61.24 37.19,61.24 37.19,94.51 38.46,94.51 38.46,26.44 90.53,26.44
RST_BTN  (via drill 0.38)
  Top 0.203: SW102.B 64.62,36.16 64.62,38.63 61.07,42.19 48.37,42.19 47.35,43.21 47.35,52.86 43.03,57.18 J102.2
  Top 0.61: SW102.B v64.88,34.32
  Bottom 0.61: C112.2 R112.2 65.51,34.95 v64.88,34.32
SQW
  Bottom 0.203: J102.6 41.76,62.26 40.24,60.73 40.24,52.35 42.18,50.41 R105.1
  Bottom 0.406: IC102.3 R105.1
V_SPI
  Top 0.61: J103.1 SJ104.1
  Bottom 0.61: J103.1 J103.2 80.03,69.88 C113.1
VCC  (via drill 0.4)
  Top 0.61: SJ104.3 66.4,67.84 | 66.4,67.84 66.4,69.62 | 66.4,69.62 66.4,73.69 v64.62,75.46 | SJ103.1 66.4,69.62 | 66.4,67.84 66.4,62.26 v68.43,60.22
  Bottom 0.61: 68.43,60.1 IC107.20 IC107.1 | 68.43,60.1 70.05,60.1 C115.1 | C114.1 66.27,77.04 | 66.27,77.04 IC106.20 | IC106.1 56.37,77.04 64.62,77.04 | v68.43,60.22 68.43,60.1 | 66.27,77.04 64.62,77.04 | v64.62,75.46 64.62,77.04

### Text on the board
tPlace: +5V | + | - | 3V | G | 0 | R1 | G1 | +12V | SPI | B1 | 5V | R2 | G2 | 12V | B2 | VCC | E | RST | TX | RX | B | A | VCC | C | D | 3V | GND | CK | LA | 35 3V 5V 02 46 34 39 41 06 13 10 12 05 | PG 3V 5V DH SC SN _B _D OE G1 R2 B2 LT | EN GD SQ FR SD LD _A _C _E R1 B1 G2 CK | EN GD 03 04 45 37 08 40 07 36 14 11 09 | CS | WR | OE | GND | SDA | SCL | EN GD SQ FR SD LD _A _C _E R1 B1 G2 CK | PG 3V 5V DH SC SN _B _D OE G1 R2 B2 LT | HUB75 | GND | DHT22 | VCC | RST | 3V | SDA | i2c | SDA | VCC | SCL | G | 0 | TX | VCC | RX | 00 3V 5V DH 05 15 16 13 | PG 3V 5V DH SC SN _B _D | EN GD SQ FR SD LD _A _C | EN GD 12 AD 04 LD _A 14 | SCL | 10 _A 15 05 01 02 GD EN | _C _A LD SD FR SQ GD EN | GND | VCC | SCL | VCC | 0 | G | 3V | SD | SC | _D _B SN SC DH 5V 3V PG | 07 08 03 06 00 5V 3V 09 | 0 | RX | G | TX | 3V | RST | G | VCC | - | RX | TX | RST
bPlace: +5V | EN GD SQ FR SD LD _A _C _E R1 B1 G2 CK | PG 3V 5V DH SC SN _B _D OE G1 R2 B2 LT | G SdA | +5V | 3V35V DH ScL